# Altium project SOM Board with RK3399.PrjPcb (part 2 of 4)

## Sheet [7]-RGMII_SDIO_SPI_GPIOs etc.SchDoc: RK3399 SOM Board Design V1.0
size A3; Author: ABC; Organization: Altium Limited; Address1: L3, 12a Rodborough Rd; Address2: Frenchs Forest; Address3: NSW; Address4: Australia 2086; DocumentNumber: 9; SheetNumber: 9; SheetTotal: 21; PROJECT CODE: A_V1.0
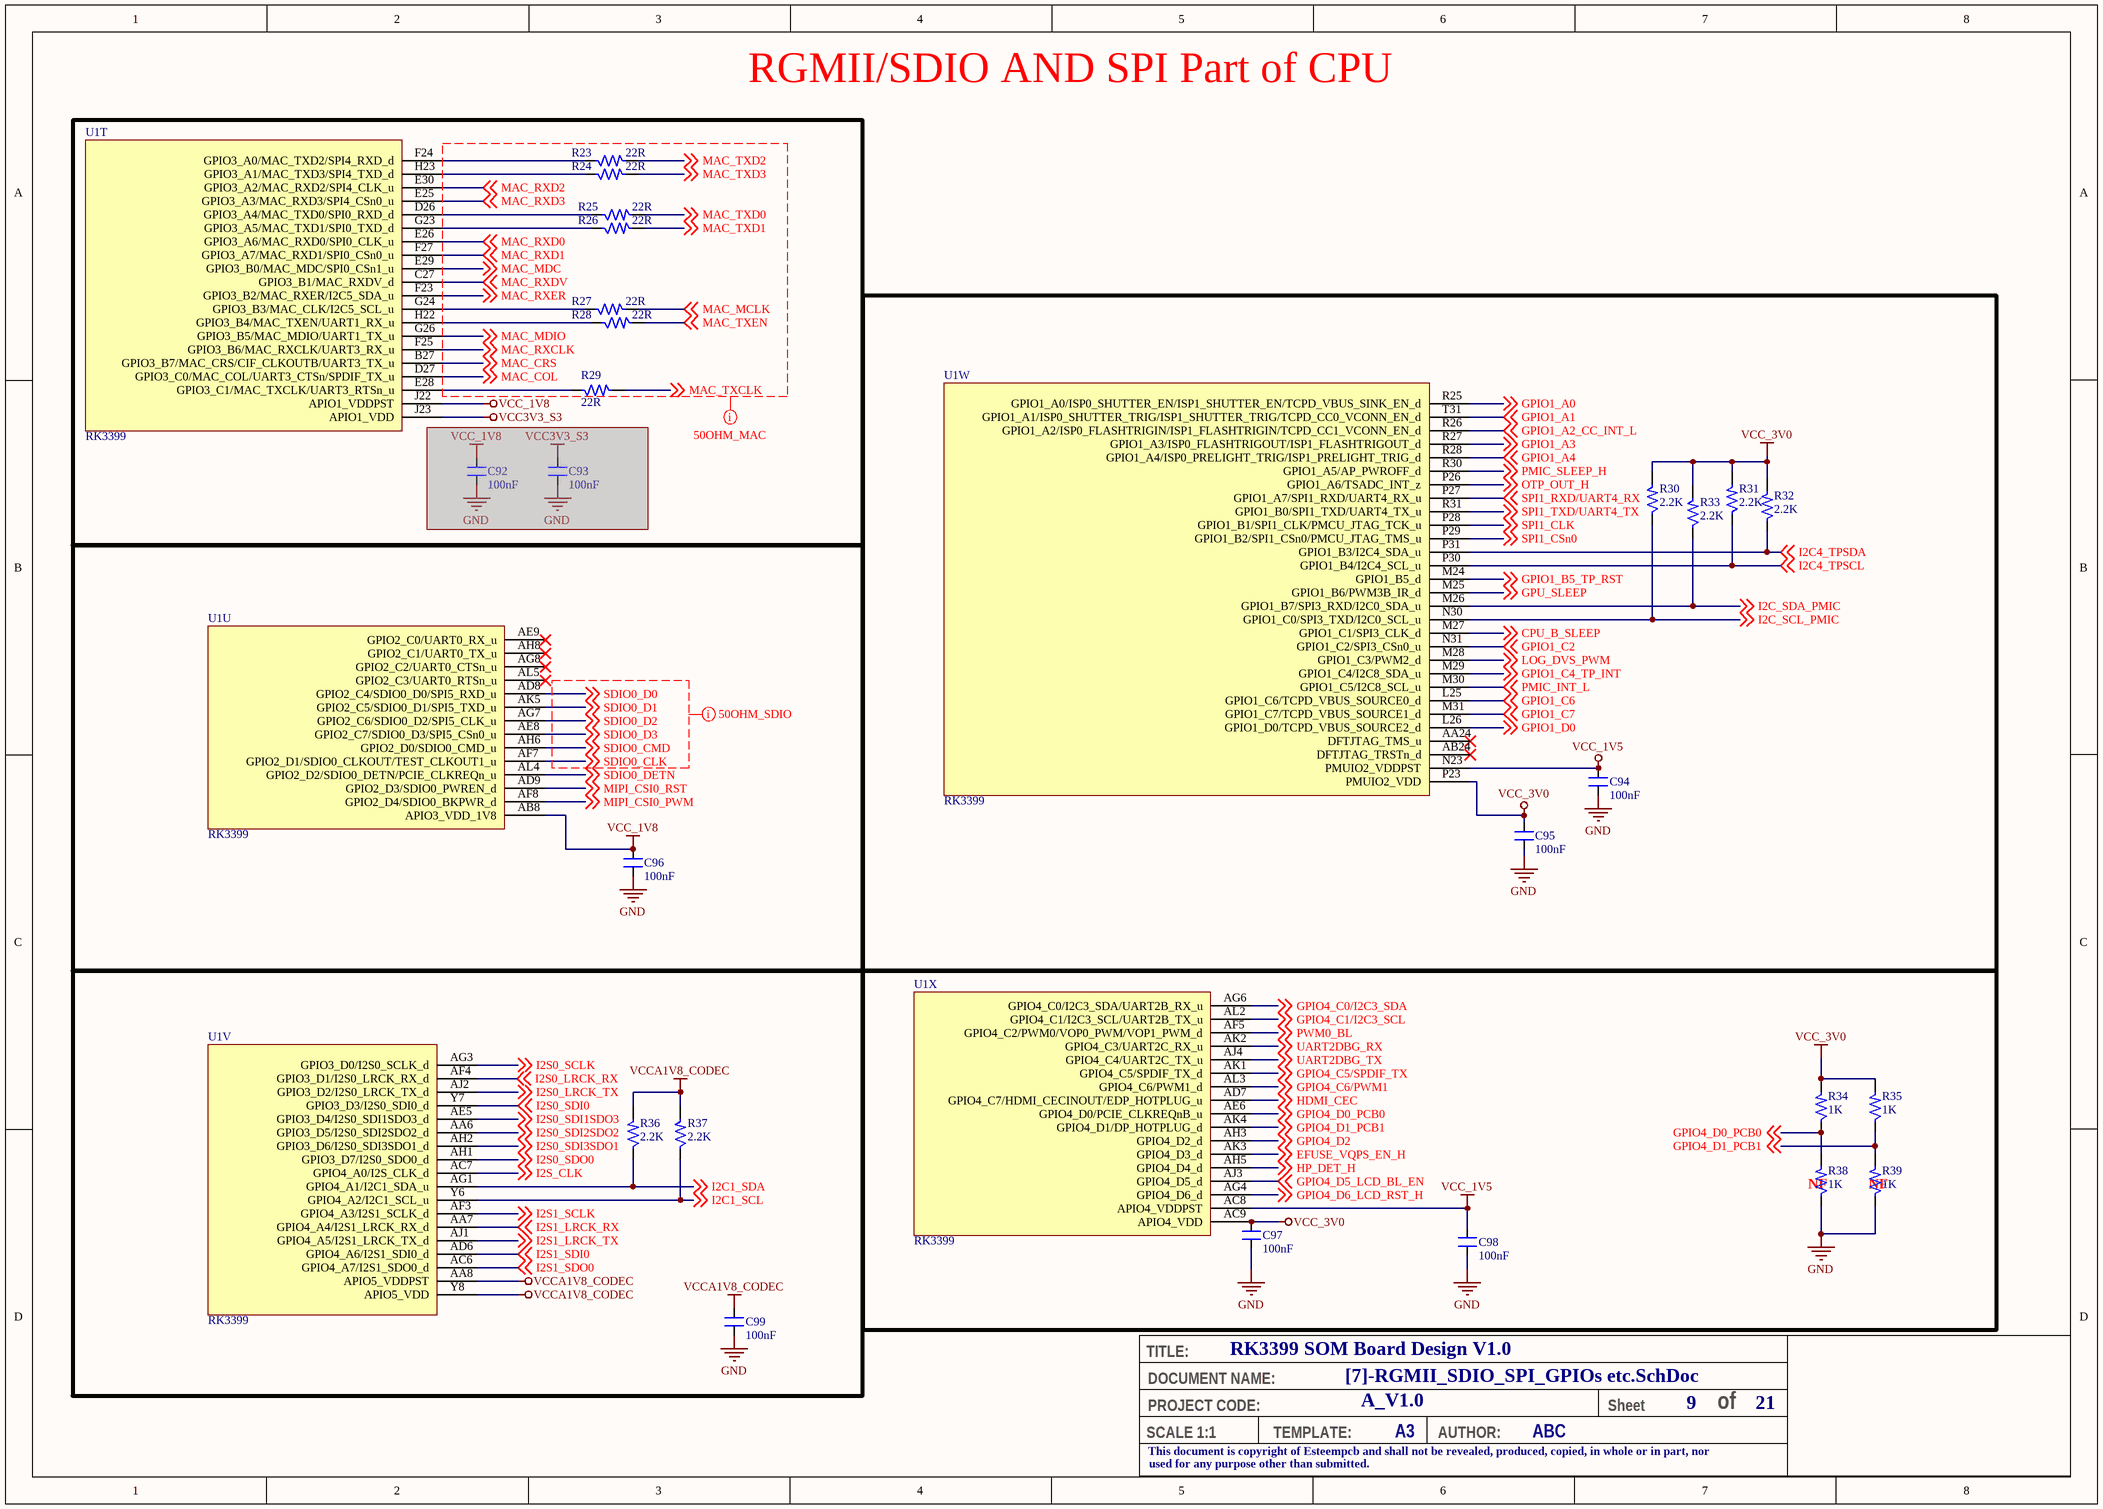
[diagram p8: [7]-RGMII_SDIO_SPI_GPIOs etc.SchDoc]

### Parts
(Parts that share a designator on the sheet are numbered #1, #2 ... from top to bottom, then left to right.)
C92#1  100nF  [CAP_0201]  (masked out: inside a compile mask, not in the netlist)
C93#1  100nF  [CAP_0201]  (masked out: inside a compile mask, not in the netlist)
C94  100nF  [CAP_0201]
C95  100nF  [CAP_0201]
C96  100nF  [CAP_0201]
C97  100nF  [CAP_0201]
C98  100nF  [CAP_0201]
C99  100nF  [CAP_0201]
R23  22R  [RES_0201]
R24  22R  [RES_0201]
R25  22R  [RES_0201]
R26  22R  [RES_0201]
R27  22R  [RES_0201]
R28  22R  [RES_0201]
R29  22R  [RES_0201]
R30  2.2K  [RES_0201]
R31  2.2K  [RES_0201]
R32  2.2K  [RES_0201]
R33  2.2K  [RES_0201]
R34  1K  [RES_0201]
R35  1K  [RES_0201]
R36  2.2K  [RES_0201]
R37  2.2K  [RES_0201]
R38  1K  [RES_0201]
R39  1K  [RES_0201]
U1  RK3399  [FBGA828_23_826X826]  (parts T,U,V,W,X of 24)

### Nets
GND: C94.1 C95.1 C96.1 C97.1 C98.1 C99.1 R38.1 R39.1
VCC3V3_S3: U1.J23(APIO1_VDD)
VCC_1V5: C94.2 C98.2 U1.AC8(APIO4_VDDPST) U1.N23(PMUIO2_VDDPST)
VCC_1V8: C96.2 U1.AB8(APIO3_VDD_1V8) U1.J22(APIO1_VDDPST)
VCC_3V0: C95.2 C97.2 R30.2 R31.2 R32.2 R33.2 R34.2 R35.2 U1.AC9(APIO4_VDD) U1.P23(PMUIO2_VDD)
VCCA1V8_CODEC: C99.2 R36.2 R37.2 U1.AA8(APIO5_VDDPST) U1.Y8(APIO5_VDD)
CPU_B_SLEEP: U1.M27(GPIO1_C1/SPI3_CLK_d) ; off-sheet CPU_B_SLEEP
EFUSE_VQPS_EN_H: U1.AK3(GPIO4_D3_d) ; off-sheet EFUSE_VQPS_EN_H
GPIO1_A0: U1.R25(GPIO1_A0/ISP0_SHUTTER_EN/ISP1_SHUTTER_EN/TCPD_VBUS_SINK_EN_d) ; off-sheet GPIO1_A0
GPIO1_A1: U1.T31(GPIO1_A1/ISP0_SHUTTER_TRIG/ISP1_SHUTTER_TRIG/TCPD_CC0_VCONN_EN_d) ; off-sheet GPIO1_A1
GPIO1_A2_CC_INT_L: U1.R26(GPIO1_A2/ISP0_FLASHTRIGIN/ISP1_FLASHTRIGIN/TCPD_CC1_VCONN_EN_d) ; off-sheet GPIO1_A2_CC_INT_L
GPIO1_A3: U1.R27(GPIO1_A3/ISP0_FLASHTRIGOUT/ISP1_FLASHTRIGOUT_d) ; off-sheet GPIO1_A3
GPIO1_A4: U1.R28(GPIO1_A4/ISP0_PRELIGHT_TRIG/ISP1_PRELIGHT_TRIG_d) ; off-sheet GPIO1_A4
GPIO1_B5_TP_RST: U1.M24(GPIO1_B5_d) ; off-sheet GPIO1_B5_TP_RST
GPIO1_C2: U1.N31(GPIO1_C2/SPI3_CSn0_u) ; off-sheet GPIO1_C2
GPIO1_C4_TP_INT: U1.M29(GPIO1_C4/I2C8_SDA_u) ; off-sheet GPIO1_C4_TP_INT
GPIO1_C6: U1.L25(GPIO1_C6/TCPD_VBUS_SOURCE0_d) ; off-sheet GPIO1_C6
GPIO1_C7: U1.M31(GPIO1_C7/TCPD_VBUS_SOURCE1_d) ; off-sheet GPIO1_C7
GPIO1_D0: U1.L26(GPIO1_D0/TCPD_VBUS_SOURCE2_d) ; off-sheet GPIO1_D0
GPIO4_C0/I2C3_SDA: U1.AG6(GPIO4_C0/I2C3_SDA/UART2B_RX_u) ; off-sheet GPIO4_C0/I2C3_SDA
GPIO4_C1/I2C3_SCL: U1.AL2(GPIO4_C1/I2C3_SCL/UART2B_TX_u) ; off-sheet GPIO4_C1/I2C3_SCL
GPIO4_C5/SPDIF_TX: U1.AK1(GPIO4_C5/SPDIF_TX_d) ; off-sheet GPIO4_C5/SPDIF_TX
GPIO4_C6/PWM1: U1.AL3(GPIO4_C6/PWM1_d) ; off-sheet GPIO4_C6/PWM1
GPIO4_D0_PCB0: R34.1 R38.2 U1.AE6(GPIO4_D0/PCIE_CLKREQnB_u) ; off-sheet GPIO4_D0_PCB0
GPIO4_D1_PCB1: R35.1 R39.2 U1.AK4(GPIO4_D1/DP_HOTPLUG_d) ; off-sheet GPIO4_D1_PCB1
GPIO4_D2: U1.AH3(GPIO4_D2_d) ; off-sheet GPIO4_D2
GPIO4_D5_LCD_BL_EN: U1.AJ3(GPIO4_D5_d) ; off-sheet GPIO4_D5_LCD_BL_EN
GPIO4_D6_LCD_RST_H: U1.AG4(GPIO4_D6_d) ; off-sheet GPIO4_D6_LCD_RST_H
GPU_SLEEP: U1.M25(GPIO1_B6/PWM3B_IR_d) ; off-sheet GPU_SLEEP
HDMI_CEC: U1.AD7(GPIO4_C7/HDMI_CECINOUT/EDP_HOTPLUG_u) ; off-sheet HDMI_CEC
HP_DET_H: U1.AH5(GPIO4_D4_d) ; off-sheet HP_DET_H
I2C1_SCL: R37.1 U1.Y6(GPIO4_A2/I2C1_SCL_u) ; off-sheet I2C1_SCL
I2C1_SDA: R36.1 U1.AG1(GPIO4_A1/I2C1_SDA_u) ; off-sheet I2C1_SDA
I2C4_TPSCL: R31.1 U1.P30(GPIO1_B4/I2C4_SCL_u) ; off-sheet I2C4_TPSCL
I2C4_TPSDA: R32.1 U1.P31(GPIO1_B3/I2C4_SDA_u) ; off-sheet I2C4_TPSDA
I2C_SCL_PMIC: R30.1 U1.N30(GPIO1_C0/SPI3_TXD/I2C0_SCL_u) ; off-sheet I2C_SCL_PMIC
I2C_SDA_PMIC: R33.1 U1.M26(GPIO1_B7/SPI3_RXD/I2C0_SDA_u) ; off-sheet I2C_SDA_PMIC
I2S0_LRCK_RX: U1.AF4(GPIO3_D1/I2S0_LRCK_RX_d) ; off-sheet I2S0_LRCK_RX
I2S0_LRCK_TX: U1.AJ2(GPIO3_D2/I2S0_LRCK_TX_d) ; off-sheet I2S0_LRCK_TX
I2S0_SCLK: U1.AG3(GPIO3_D0/I2S0_SCLK_d) ; off-sheet I2S0_SCLK
I2S0_SDI0: U1.Y7(GPIO3_D3/I2S0_SDI0_d) ; off-sheet I2S0_SDI0
I2S0_SDI1SDO3: U1.AE5(GPIO3_D4/I2S0_SDI1SDO3_d) ; off-sheet I2S0_SDI1SDO3
I2S0_SDI2SDO2: U1.AA6(GPIO3_D5/I2S0_SDI2SDO2_d) ; off-sheet I2S0_SDI2SDO2
I2S0_SDI3SDO1: U1.AH2(GPIO3_D6/I2S0_SDI3SDO1_d) ; off-sheet I2S0_SDI3SDO1
I2S0_SDO0: U1.AH1(GPIO3_D7/I2S0_SDO0_d) ; off-sheet I2S0_SDO0
I2S1_LRCK_RX: U1.AA7(GPIO4_A4/I2S1_LRCK_RX_d) ; off-sheet I2S1_LRCK_RX
I2S1_LRCK_TX: U1.AJ1(GPIO4_A5/I2S1_LRCK_TX_d) ; off-sheet I2S1_LRCK_TX
I2S1_SCLK: U1.AF3(GPIO4_A3/I2S1_SCLK_d) ; off-sheet I2S1_SCLK
I2S1_SDI0: U1.AD6(GPIO4_A6/I2S1_SDI0_d) ; off-sheet I2S1_SDI0
I2S1_SDO0: U1.AC6(GPIO4_A7/I2S1_SDO0_d) ; off-sheet I2S1_SDO0
I2S_CLK: U1.AC7(GPIO4_A0/I2S_CLK_d) ; off-sheet I2S_CLK
LOG_DVS_PWM: U1.M28(GPIO1_C3/PWM2_d) ; off-sheet LOG_DVS_PWM
MAC_COL: U1.D27(GPIO3_C0/MAC_COL/UART3_CTSn/SPDIF_TX_u) ; off-sheet MAC_COL
MAC_CRS: U1.B27(GPIO3_B7/MAC_CRS/CIF_CLKOUTB/UART3_TX_u) ; off-sheet MAC_CRS
MAC_MCLK: R27.2 ; off-sheet MAC_MCLK
MAC_MDC: U1.E29(GPIO3_B0/MAC_MDC/SPI0_CSn1_u) ; off-sheet MAC_MDC
MAC_MDIO: U1.G26(GPIO3_B5/MAC_MDIO/UART1_TX_u) ; off-sheet MAC_MDIO
MAC_RXCLK: U1.F25(GPIO3_B6/MAC_RXCLK/UART3_RX_u) ; off-sheet MAC_RXCLK
MAC_RXD0: U1.E26(GPIO3_A6/MAC_RXD0/SPI0_CLK_u) ; off-sheet MAC_RXD0
MAC_RXD1: U1.F27(GPIO3_A7/MAC_RXD1/SPI0_CSn0_u) ; off-sheet MAC_RXD1
MAC_RXD2: U1.E30(GPIO3_A2/MAC_RXD2/SPI4_CLK_u) ; off-sheet MAC_RXD2
MAC_RXD3: U1.E25(GPIO3_A3/MAC_RXD3/SPI4_CSn0_u) ; off-sheet MAC_RXD3
MAC_RXDV: U1.C27(GPIO3_B1/MAC_RXDV_d) ; off-sheet MAC_RXDV
MAC_RXER: U1.F23(GPIO3_B2/MAC_RXER/I2C5_SDA_u) ; off-sheet MAC_RXER
MAC_TXCLK: R29.2 ; off-sheet MAC_TXCLK
MAC_TXD0: R25.2 ; off-sheet MAC_TXD0
MAC_TXD1: R26.2 ; off-sheet MAC_TXD1
MAC_TXD2: R23.2 ; off-sheet MAC_TXD2
MAC_TXD3: R24.2 ; off-sheet MAC_TXD3
MAC_TXEN: R28.2 ; off-sheet MAC_TXEN
MIPI_CSI0_PWM: U1.AF8(GPIO2_D4/SDIO0_BKPWR_d) ; off-sheet MIPI_CSI0_PWM
MIPI_CSI0_RST: U1.AD9(GPIO2_D3/SDIO0_PWREN_d) ; off-sheet MIPI_CSI0_RST
OTP_OUT_H: U1.P26(GPIO1_A6/TSADC_INT_z) ; off-sheet OTP_OUT_H
PMIC_INT_L: U1.M30(GPIO1_C5/I2C8_SCL_u) ; off-sheet PMIC_INT_L
PMIC_SLEEP_H: U1.R30(GPIO1_A5/AP_PWROFF_d) ; off-sheet PMIC_SLEEP_H
PWM0_BL: U1.AF5(GPIO4_C2/PWM0/VOP0_PWM/VOP1_PWM_d) ; off-sheet PWM0_BL
SDIO0_CLK: U1.AF7(GPIO2_D1/SDIO0_CLKOUT/TEST_CLKOUT1_u) ; off-sheet SDIO0_CLK
SDIO0_CMD: U1.AH6(GPIO2_D0/SDIO0_CMD_u) ; off-sheet SDIO0_CMD
SDIO0_D0: U1.AD8(GPIO2_C4/SDIO0_D0/SPI5_RXD_u) ; off-sheet SDIO0_D0
SDIO0_D1: U1.AK5(GPIO2_C5/SDIO0_D1/SPI5_TXD_u) ; off-sheet SDIO0_D1
SDIO0_D2: U1.AG7(GPIO2_C6/SDIO0_D2/SPI5_CLK_u) ; off-sheet SDIO0_D2
SDIO0_D3: U1.AE8(GPIO2_C7/SDIO0_D3/SPI5_CSn0_u) ; off-sheet SDIO0_D3
SDIO0_DETN: U1.AL4(GPIO2_D2/SDIO0_DETN/PCIE_CLKREQn_u) ; off-sheet SDIO0_DETN
SPI1_CLK: U1.P28(GPIO1_B1/SPI1_CLK/PMCU_JTAG_TCK_u) ; off-sheet SPI1_CLK
SPI1_CSn0: U1.P29(GPIO1_B2/SPI1_CSn0/PMCU_JTAG_TMS_u) ; off-sheet SPI1_CSn0
SPI1_RXD/UART4_RX: U1.P27(GPIO1_A7/SPI1_RXD/UART4_RX_u) ; off-sheet SPI1_RXD/UART4_RX
SPI1_TXD/UART4_TX: U1.R31(GPIO1_B0/SPI1_TXD/UART4_TX_u) ; off-sheet SPI1_TXD/UART4_TX
UART2DBG_RX: U1.AK2(GPIO4_C3/UART2C_RX_u) ; off-sheet UART2DBG_RX
UART2DBG_TX: U1.AJ4(GPIO4_C4/UART2C_TX_u) ; off-sheet UART2DBG_TX
NetR23_1: R23.1 U1.F24(GPIO3_A0/MAC_TXD2/SPI4_RXD_d)
NetR24_1: R24.1 U1.H23(GPIO3_A1/MAC_TXD3/SPI4_TXD_d)
NetR25_1: R25.1 U1.D26(GPIO3_A4/MAC_TXD0/SPI0_RXD_d)
NetR26_1: R26.1 U1.G23(GPIO3_A5/MAC_TXD1/SPI0_TXD_d)
NetR27_1: R27.1 U1.G24(GPIO3_B3/MAC_CLK/I2C5_SCL_u)
NetR28_1: R28.1 U1.H22(GPIO3_B4/MAC_TXEN/UART1_RX_u)
NetR29_1: R29.1 U1.E28(GPIO3_C1/MAC_TXCLK/UART3_RTSn_u)

Not connected (* = marked no-connect by the designer): U1 AA24(DFTJTAG_TMS_u)* AB24(DFTJTAG_TRSTn_d)* AE9(GPIO2_C0/UART0_RX_u)* AG8(GPIO2_C2/UART0_CTSn_u)* AH8(GPIO2_C1/UART0_TX_u)* AL5(GPIO2_C3/UART0_RTSn_u)*

### Layout directives
net class 50OHM_MAC: MAC_COL, MAC_CRS, MAC_MCLK, MAC_MDC, MAC_MDIO, MAC_RXCLK, MAC_RXD0, MAC_RXD1, MAC_RXD2, MAC_RXD3, MAC_RXDV, MAC_RXER, MAC_TXCLK, MAC_TXD0, MAC_TXD1, MAC_TXD2, MAC_TXD3, MAC_TXEN
net class 50OHM_SDIO: SDIO0_CLK, SDIO0_CMD, SDIO0_D0, SDIO0_D1, SDIO0_D2, SDIO0_D3

### Notes on the sheet
- RGMII/SDIO AND SPI Part of CPU
- (near R38) NF
- (near R39) NF
- TITLE:
- DOCUMENT NAME:
- SCALE 1:1
- This document is copyright of Esteempcb and shall not be revealed, produced, copied, in whole or in part, nor
- PROJECT CODE:
- TEMPLATE:
- A3
- AUTHOR:
- Sheet
- of
- used for any purpose other than submitted.

### Library data of the parts
C92#1 C93#1 C94-C99 = CAP_100nF-25V-10%-0201: as C9 on sheet [1]-Power Pins Page of RK3399; Case/Package: 0201; Supplier-1: Digikey
R23-R29 = RES_22R-0.05W-1%-0201: 22 Ohms ±1% 0.05W, 1/20W Chip Resistor 0201 (0603 Metric) Moisture Resistant Thick Film /; Manufacturer: Yageo; Manufacturer Part Number: RC0201FR-0722RL; Case/Package: 0201; Supplier-1: Digikey
R30-R33 R36 R37 = RES_2.2K-0.05W-1%-0201: 2.2 kOhms ±1% 0.05W, 1/20W Chip Resistor 0201 (0603 Metric) Thick Film /; Manufacturer: Stackpole Electronics Inc; Manufacturer Part Number: RMCF0201FT2K20; Case/Package: 0201; Supplier-1: Digikey
R34 R35 R38 R39 = RES_1K-0.05W-1%-0201: 1 kOhms ±1% 0.05W, 1/20W Chip Resistor 0201 (0603 Metric) Thick Film /; Manufacturer: Yageo; Manufacturer Part Number: RC0201FR-071KL; Case/Package: 0201; Supplier-1: Digikey
U1 = IC_RK3399-FCBGA828: as U1 on sheet [1]-Power Pins Page of RK3399; Manufacturer Part Number: RK3399; Case/Package: FCBGA828; Supplier-1: Rockchip

## Sheet [8]-RK3399 SDRAM Page.SchDoc: RK3399 SOM Board Design V1.0
size A3; Author: ABC; Organization: Altium Limited; Address1: L3, 12a Rodborough Rd; Address2: Frenchs Forest; Address3: NSW; Address4: Australia 2086; DocumentNumber: 10; SheetNumber: 10; SheetTotal: 21; PROJECT CODE: A_V1.0
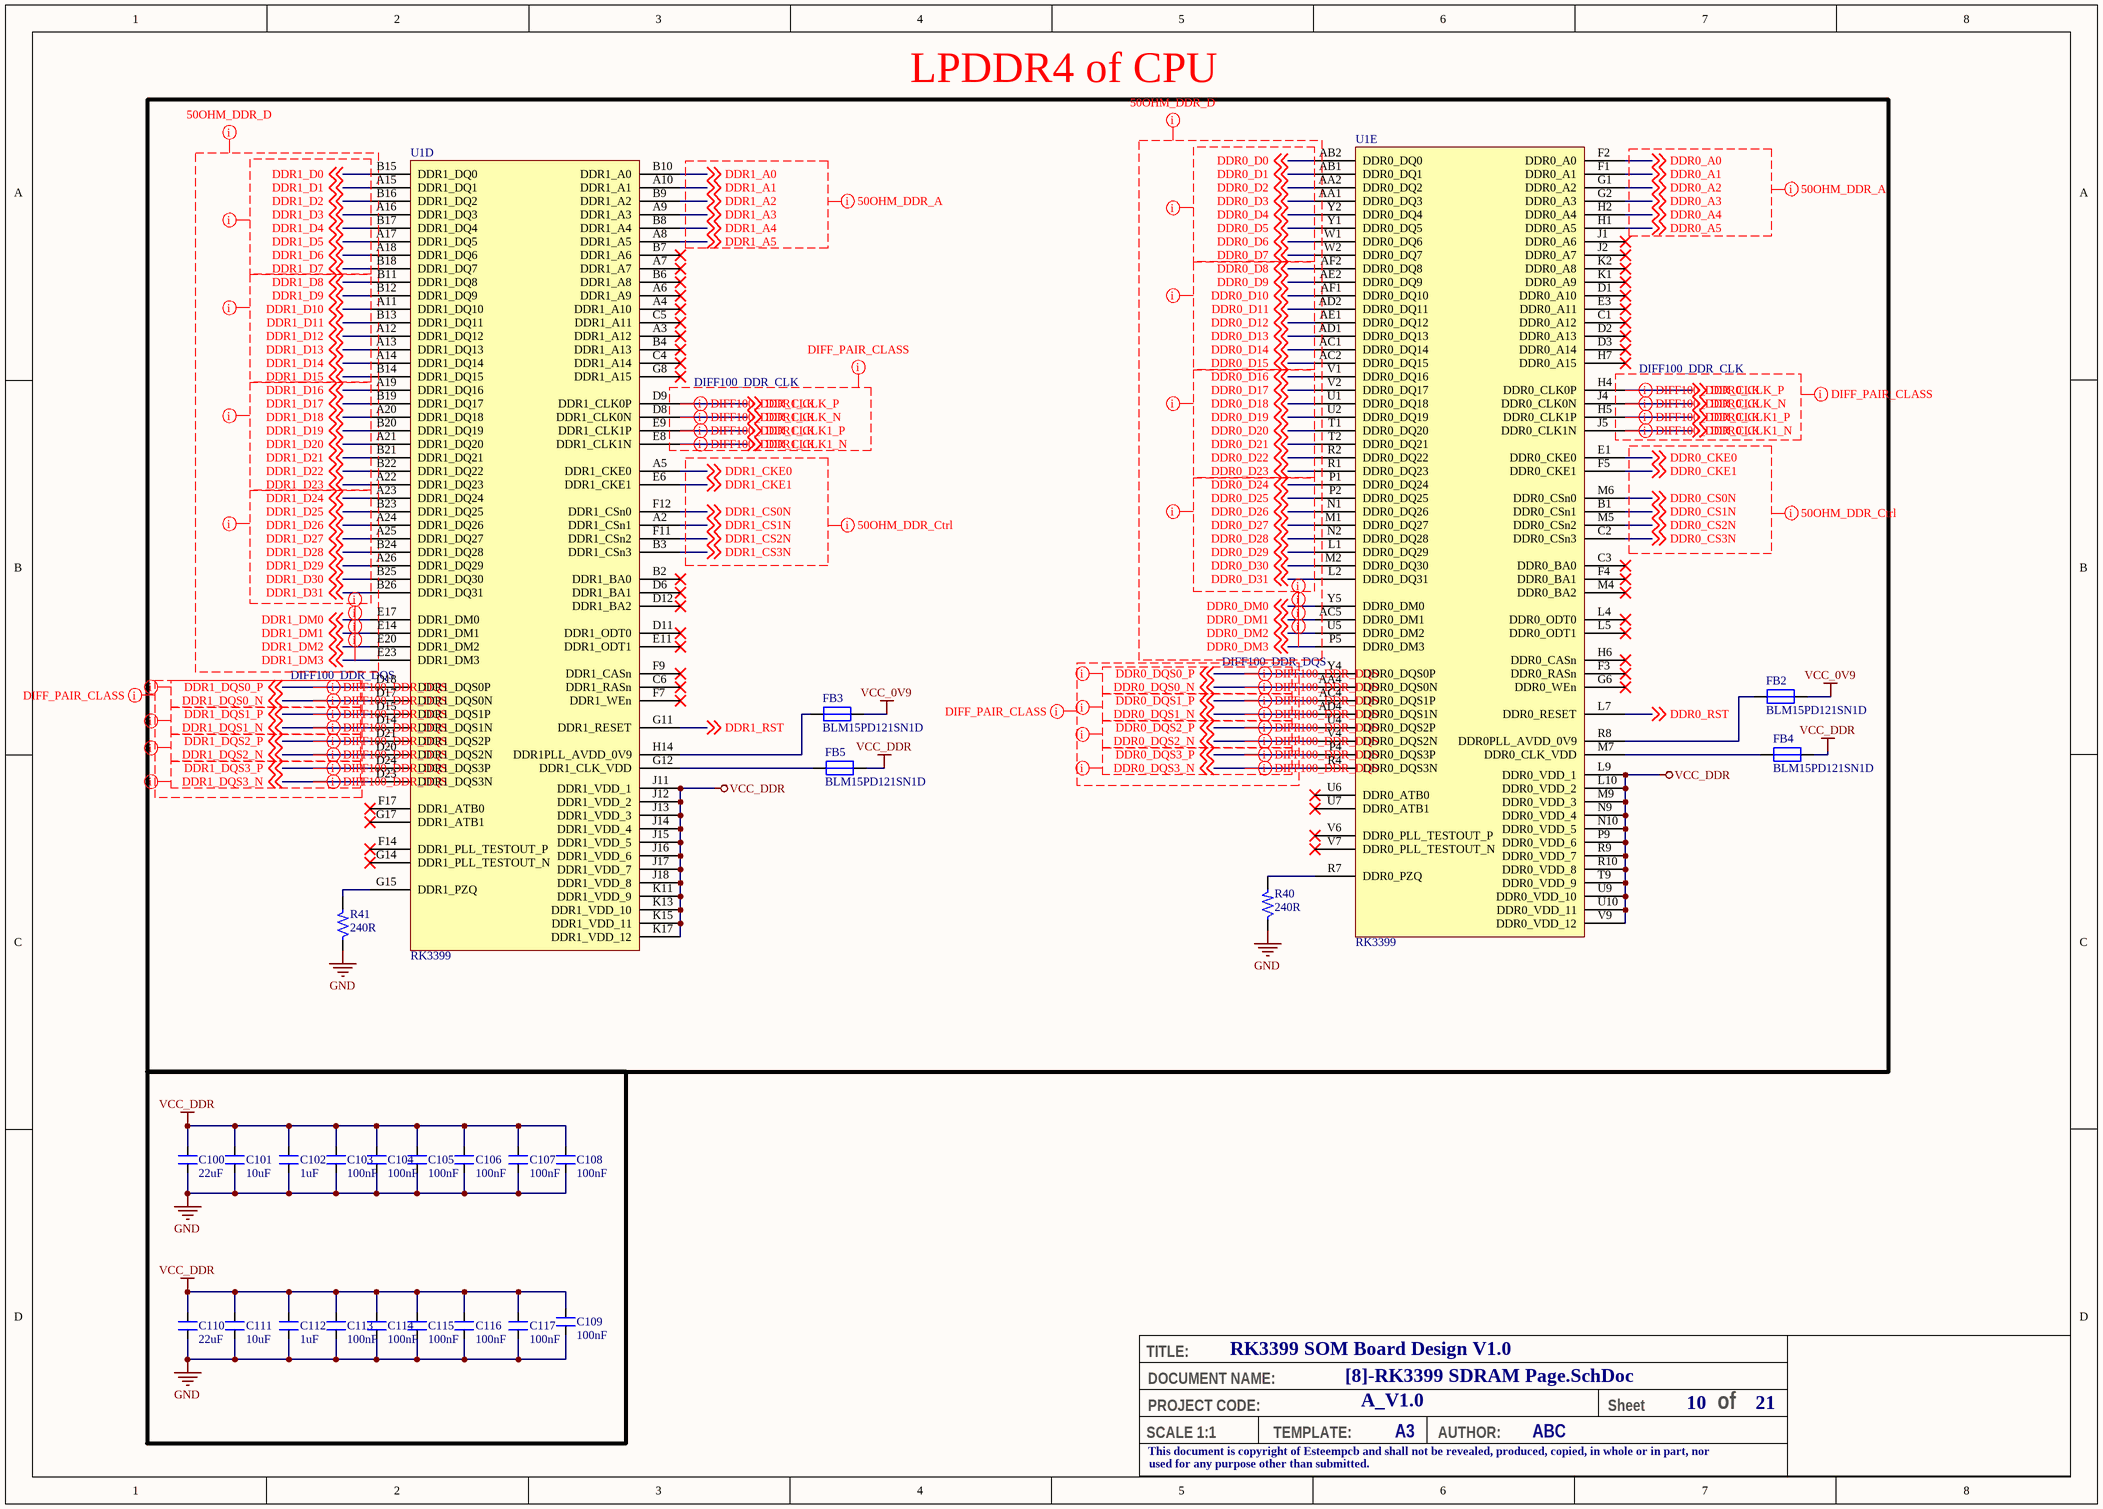
[diagram p9: [8]-RK3399 SDRAM Page.SchDoc]

### Parts
C100  22uF  [CAP_0402]
C101  10uF  [CAP_0402]
C102  1uF  [CAP_0201]
C103  100nF  [CAP_0201]
C104  100nF  [CAP_0201]
C105  100nF  [CAP_0201]
C106  100nF  [CAP_0201]
C107  100nF  [CAP_0201]
C108  100nF  [CAP_0201]
C109  100nF  [CAP_0201]
C110  22uF  [CAP_0402]
C111  10uF  [CAP_0402]
C112  1uF  [CAP_0201]
C113  100nF  [CAP_0201]
C114  100nF  [CAP_0201]
C115  100nF  [CAP_0201]
C116  100nF  [CAP_0201]
C117  100nF  [CAP_0201]
FB2  BLM15PD121SN1D  [RES_0402]
FB3  BLM15PD121SN1D  [RES_0402]
FB4  BLM15PD121SN1D  [RES_0402]
FB5  BLM15PD121SN1D  [RES_0402]
R40  240R  [RES_0201]
R41  240R  [RES_0201]
U1  RK3399  [FBGA828_23_826X826]  (parts D,E of 24)

### Blocks framed on the sheet
LPDDR4 of CPU: FB2-FB5 R40 R41 U1

### Nets
GND: C100.1 C101.1 C102.1 C103.1 C104.1 C105.1 C106.1 C107.1 C108.1 C109.1 C110.1 C111.1 C112.1 C113.1 C114.1 C115.1 C116.1 C117.1 R40.1 R41.1
VCC_0V9: FB2.2 FB3.2
VCC_DDR: C100.2 C101.2 C102.2 C103.2 C104.2 C105.2 C106.2 C107.2 C108.2 C109.2 C110.2 C111.2 C112.2 C113.2 C114.2 C115.2 C116.2 C117.2 FB4.2 FB5.2 U1.J11(DDR1_VDD_1) U1.J12(DDR1_VDD_2) U1.J13(DDR1_VDD_3) U1.J14(DDR1_VDD_4) U1.J15(DDR1_VDD_5) U1.J16(DDR1_VDD_6) U1.J17(DDR1_VDD_7) U1.J18(DDR1_VDD_8) U1.K11(DDR1_VDD_9) U1.K13(DDR1_VDD_10) U1.K15(DDR1_VDD_11) U1.K17(DDR1_VDD_12) U1.L9(DDR0_VDD_1) U1.L10(DDR0_VDD_2) U1.M9(DDR0_VDD_3) U1.N9(DDR0_VDD_4) U1.N10(DDR0_VDD_5) U1.P9(DDR0_VDD_6) U1.R9(DDR0_VDD_7) U1.R10(DDR0_VDD_8) U1.T9(DDR0_VDD_9) U1.U9(DDR0_VDD_10) U1.U10(DDR0_VDD_11) U1.V9(DDR0_VDD_12)
DDR0_A0: U1.F2(DDR0_A0) ; off-sheet DDR0_A0
DDR0_A1: U1.F1(DDR0_A1) ; off-sheet DDR0_A1
DDR0_A2: U1.G1(DDR0_A2) ; off-sheet DDR0_A2
DDR0_A3: U1.G2(DDR0_A3) ; off-sheet DDR0_A3
DDR0_A4: U1.H2(DDR0_A4) ; off-sheet DDR0_A4
DDR0_A5: U1.H1(DDR0_A5) ; off-sheet DDR0_A5
DDR0_CKE0: U1.E1(DDR0_CKE0) ; off-sheet DDR0_CKE0
DDR0_CKE1: U1.F5(DDR0_CKE1) ; off-sheet DDR0_CKE1
DDR0_CLK1_N: U1.J5(DDR0_CLK1N) ; off-sheet DDR0_CLK1_N
DDR0_CLK1_P: U1.H5(DDR0_CLK1P) ; off-sheet DDR0_CLK1_P
DDR0_CLK_N: U1.J4(DDR0_CLK0N) ; off-sheet DDR0_CLK_N
DDR0_CLK_P: U1.H4(DDR0_CLK0P) ; off-sheet DDR0_CLK_P
DDR0_CS0N: U1.M6(DDR0_CSn0) ; off-sheet DDR0_CS0N
DDR0_CS1N: U1.B1(DDR0_CSn1) ; off-sheet DDR0_CS1N
DDR0_CS2N: U1.M5(DDR0_CSn2) ; off-sheet DDR0_CS2N
DDR0_CS3N: U1.C2(DDR0_CSn3) ; off-sheet DDR0_CS3N
DDR0_D0: U1.AB2(DDR0_DQ0) ; off-sheet DDR0_D0
DDR0_D1: U1.AB1(DDR0_DQ1) ; off-sheet DDR0_D1
DDR0_D2: U1.AA2(DDR0_DQ2) ; off-sheet DDR0_D2
DDR0_D3: U1.AA1(DDR0_DQ3) ; off-sheet DDR0_D3
DDR0_D4: U1.Y2(DDR0_DQ4) ; off-sheet DDR0_D4
DDR0_D5: U1.Y1(DDR0_DQ5) ; off-sheet DDR0_D5
DDR0_D6: U1.W1(DDR0_DQ6) ; off-sheet DDR0_D6
DDR0_D7: U1.W2(DDR0_DQ7) ; off-sheet DDR0_D7
DDR0_D8: U1.AF2(DDR0_DQ8) ; off-sheet DDR0_D8
DDR0_D9: U1.AE2(DDR0_DQ9) ; off-sheet DDR0_D9
DDR0_D10: U1.AF1(DDR0_DQ10) ; off-sheet DDR0_D10
DDR0_D11: U1.AD2(DDR0_DQ11) ; off-sheet DDR0_D11
DDR0_D12: U1.AE1(DDR0_DQ12) ; off-sheet DDR0_D12
DDR0_D13: U1.AD1(DDR0_DQ13) ; off-sheet DDR0_D13
DDR0_D14: U1.AC1(DDR0_DQ14) ; off-sheet DDR0_D14
DDR0_D15: U1.AC2(DDR0_DQ15) ; off-sheet DDR0_D15
DDR0_D16: U1.V1(DDR0_DQ16) ; off-sheet DDR0_D16
DDR0_D17: U1.V2(DDR0_DQ17) ; off-sheet DDR0_D17
DDR0_D18: U1.U1(DDR0_DQ18) ; off-sheet DDR0_D18
DDR0_D19: U1.U2(DDR0_DQ19) ; off-sheet DDR0_D19
DDR0_D20: U1.T1(DDR0_DQ20) ; off-sheet DDR0_D20
DDR0_D21: U1.T2(DDR0_DQ21) ; off-sheet DDR0_D21
DDR0_D22: U1.R2(DDR0_DQ22) ; off-sheet DDR0_D22
DDR0_D23: U1.R1(DDR0_DQ23) ; off-sheet DDR0_D23
DDR0_D24: U1.P1(DDR0_DQ24) ; off-sheet DDR0_D24
DDR0_D25: U1.P2(DDR0_DQ25) ; off-sheet DDR0_D25
DDR0_D26: U1.N1(DDR0_DQ26) ; off-sheet DDR0_D26
DDR0_D27: U1.M1(DDR0_DQ27) ; off-sheet DDR0_D27
DDR0_D28: U1.N2(DDR0_DQ28) ; off-sheet DDR0_D28
DDR0_D29: U1.L1(DDR0_DQ29) ; off-sheet DDR0_D29
DDR0_D30: U1.M2(DDR0_DQ30) ; off-sheet DDR0_D30
DDR0_D31: U1.L2(DDR0_DQ31) ; off-sheet DDR0_D31
DDR0_DM0: U1.Y5(DDR0_DM0) ; off-sheet DDR0_DM0
DDR0_DM1: U1.AC5(DDR0_DM1) ; off-sheet DDR0_DM1
DDR0_DM2: U1.U5(DDR0_DM2) ; off-sheet DDR0_DM2
DDR0_DM3: U1.P5(DDR0_DM3) ; off-sheet DDR0_DM3
DDR0_DQS0_N: U1.AA4(DDR0_DQS0N) ; off-sheet DDR0_DQS0_N
DDR0_DQS0_P: U1.Y4(DDR0_DQS0P) ; off-sheet DDR0_DQS0_P
DDR0_DQS1_N: U1.AD4(DDR0_DQS1N) ; off-sheet DDR0_DQS1_N
DDR0_DQS1_P: U1.AC4(DDR0_DQS1P) ; off-sheet DDR0_DQS1_P
DDR0_DQS2_N: U1.V4(DDR0_DQS2N) ; off-sheet DDR0_DQS2_N
DDR0_DQS2_P: U1.U4(DDR0_DQS2P) ; off-sheet DDR0_DQS2_P
DDR0_DQS3_N: U1.R4(DDR0_DQS3N) ; off-sheet DDR0_DQS3_N
DDR0_DQS3_P: U1.P4(DDR0_DQS3P) ; off-sheet DDR0_DQS3_P
DDR0_RST: U1.L7(DDR0_RESET) ; off-sheet DDR0_RST
DDR1_A0: U1.B10(DDR1_A0) ; off-sheet DDR1_A0
DDR1_A1: U1.A10(DDR1_A1) ; off-sheet DDR1_A1
DDR1_A2: U1.B9(DDR1_A2) ; off-sheet DDR1_A2
DDR1_A3: U1.A9(DDR1_A3) ; off-sheet DDR1_A3
DDR1_A4: U1.B8(DDR1_A4) ; off-sheet DDR1_A4
DDR1_A5: U1.A8(DDR1_A5) ; off-sheet DDR1_A5
DDR1_CKE0: U1.A5(DDR1_CKE0) ; off-sheet DDR1_CKE0
DDR1_CKE1: U1.E6(DDR1_CKE1) ; off-sheet DDR1_CKE1
DDR1_CLK1_N: U1.E8(DDR1_CLK1N) ; off-sheet DDR1_CLK1_N
DDR1_CLK1_P: U1.E9(DDR1_CLK1P) ; off-sheet DDR1_CLK1_P
DDR1_CLK_N: U1.D8(DDR1_CLK0N) ; off-sheet DDR1_CLK_N
DDR1_CLK_P: U1.D9(DDR1_CLK0P) ; off-sheet DDR1_CLK_P
DDR1_CS0N: U1.F12(DDR1_CSn0) ; off-sheet DDR1_CS0N
DDR1_CS1N: U1.A2(DDR1_CSn1) ; off-sheet DDR1_CS1N
DDR1_CS2N: U1.F11(DDR1_CSn2) ; off-sheet DDR1_CS2N
DDR1_CS3N: U1.B3(DDR1_CSn3) ; off-sheet DDR1_CS3N
DDR1_D0: U1.B15(DDR1_DQ0) ; off-sheet DDR1_D0
DDR1_D1: U1.A15(DDR1_DQ1) ; off-sheet DDR1_D1
DDR1_D2: U1.B16(DDR1_DQ2) ; off-sheet DDR1_D2
DDR1_D3: U1.A16(DDR1_DQ3) ; off-sheet DDR1_D3
DDR1_D4: U1.B17(DDR1_DQ4) ; off-sheet DDR1_D4
DDR1_D5: U1.A17(DDR1_DQ5) ; off-sheet DDR1_D5
DDR1_D6: U1.A18(DDR1_DQ6) ; off-sheet DDR1_D6
DDR1_D7: U1.B18(DDR1_DQ7) ; off-sheet DDR1_D7
DDR1_D8: U1.B11(DDR1_DQ8) ; off-sheet DDR1_D8
DDR1_D9: U1.B12(DDR1_DQ9) ; off-sheet DDR1_D9
DDR1_D10: U1.A11(DDR1_DQ10) ; off-sheet DDR1_D10
DDR1_D11: U1.B13(DDR1_DQ11) ; off-sheet DDR1_D11
DDR1_D12: U1.A12(DDR1_DQ12) ; off-sheet DDR1_D12
DDR1_D13: U1.A13(DDR1_DQ13) ; off-sheet DDR1_D13
DDR1_D14: U1.A14(DDR1_DQ14) ; off-sheet DDR1_D14
DDR1_D15: U1.B14(DDR1_DQ15) ; off-sheet DDR1_D15
DDR1_D16: U1.A19(DDR1_DQ16) ; off-sheet DDR1_D16
DDR1_D17: U1.B19(DDR1_DQ17) ; off-sheet DDR1_D17
DDR1_D18: U1.A20(DDR1_DQ18) ; off-sheet DDR1_D18
DDR1_D19: U1.B20(DDR1_DQ19) ; off-sheet DDR1_D19
DDR1_D20: U1.A21(DDR1_DQ20) ; off-sheet DDR1_D20
DDR1_D21: U1.B21(DDR1_DQ21) ; off-sheet DDR1_D21
DDR1_D22: U1.B22(DDR1_DQ22) ; off-sheet DDR1_D22
DDR1_D23: U1.A22(DDR1_DQ23) ; off-sheet DDR1_D23
DDR1_D24: U1.A23(DDR1_DQ24) ; off-sheet DDR1_D24
DDR1_D25: U1.B23(DDR1_DQ25) ; off-sheet DDR1_D25
DDR1_D26: U1.A24(DDR1_DQ26) ; off-sheet DDR1_D26
DDR1_D27: U1.A25(DDR1_DQ27) ; off-sheet DDR1_D27
DDR1_D28: U1.B24(DDR1_DQ28) ; off-sheet DDR1_D28
DDR1_D29: U1.A26(DDR1_DQ29) ; off-sheet DDR1_D29
DDR1_D30: U1.B25(DDR1_DQ30) ; off-sheet DDR1_D30
DDR1_D31: U1.B26(DDR1_DQ31) ; off-sheet DDR1_D31
DDR1_DM0: U1.E17(DDR1_DM0) ; off-sheet DDR1_DM0
DDR1_DM1: U1.E14(DDR1_DM1) ; off-sheet DDR1_DM1
DDR1_DM2: U1.E20(DDR1_DM2) ; off-sheet DDR1_DM2
DDR1_DM3: U1.E23(DDR1_DM3) ; off-sheet DDR1_DM3
DDR1_DQS0_N: U1.D17(DDR1_DQS0N) ; off-sheet DDR1_DQS0_N
DDR1_DQS0_P: U1.D18(DDR1_DQS0P) ; off-sheet DDR1_DQS0_P
DDR1_DQS1_N: U1.D14(DDR1_DQS1N) ; off-sheet DDR1_DQS1_N
DDR1_DQS1_P: U1.D15(DDR1_DQS1P) ; off-sheet DDR1_DQS1_P
DDR1_DQS2_N: U1.D20(DDR1_DQS2N) ; off-sheet DDR1_DQS2_N
DDR1_DQS2_P: U1.D21(DDR1_DQS2P) ; off-sheet DDR1_DQS2_P
DDR1_DQS3_N: U1.D23(DDR1_DQS3N) ; off-sheet DDR1_DQS3_N
DDR1_DQS3_P: U1.D24(DDR1_DQS3P) ; off-sheet DDR1_DQS3_P
DDR1_RST: U1.G11(DDR1_RESET) ; off-sheet DDR1_RST
NetFB2_1: FB2.1 U1.R8(DDR0PLL_AVDD_0V9)
NetFB3_1: FB3.1 U1.H14(DDR1PLL_AVDD_0V9)
NetFB4_1: FB4.1 U1.M7(DDR0_CLK_VDD)
NetFB5_1: FB5.1 U1.G12(DDR1_CLK_VDD)
NetR40_2: R40.2 U1.R7(DDR0_PZQ)
NetR41_2: R41.2 U1.G15(DDR1_PZQ)

Not connected (* = marked no-connect by the designer): U1 A3(DDR1_A12)* A4(DDR1_A10)* A6(DDR1_A9)* A7(DDR1_A7)* B2(DDR1_BA0)* B4(DDR1_A13)* B6(DDR1_A8)* B7(DDR1_A6)* C1(DDR0_A12)* C3(DDR0_BA0)* C4(DDR1_A14)* C5(DDR1_A11)* C6(DDR1_RASn)* D1(DDR0_A10)* D2(DDR0_A13)* D3(DDR0_A14)* D6(DDR1_BA1)* D11(DDR1_ODT0)* D12(DDR1_BA2)* E3(DDR0_A11)* E11(DDR1_ODT1)* F3(DDR0_RASn)* F4(DDR0_BA1)* F7(DDR1_WEn)* F9(DDR1_CASn)* F14(DDR1_PLL_TESTOUT_P)* F17(DDR1_ATB0)* G6(DDR0_WEn)* G8(DDR1_A15)* G14(DDR1_PLL_TESTOUT_N)* G17(DDR1_ATB1)* H6(DDR0_CASn)* H7(DDR0_A15)* J1(DDR0_A6)* J2(DDR0_A7)* K1(DDR0_A9)* K2(DDR0_A8)* L4(DDR0_ODT0)* L5(DDR0_ODT1)* M4(DDR0_BA2)* U6(DDR0_ATB0)* U7(DDR0_ATB1)* V6(DDR0_PLL_TESTOUT_P)* V7(DDR0_PLL_TESTOUT_N)*

### Layout directives
net class 50OHM_DDR_D: DDR0_D0, DDR0_D1, DDR0_D2, DDR0_D3, DDR0_D4, DDR0_D5, DDR0_D6, DDR0_D7, DDR0_D8, DDR0_D9, DDR0_D10, DDR0_D11, DDR0_D12, DDR0_D13, DDR0_D14, DDR0_D15, DDR0_D16, DDR0_D17, DDR0_D18, DDR0_D19, DDR0_D20, DDR0_D21, DDR0_D22, DDR0_D23, DDR0_D24, DDR0_D25, DDR0_D26, DDR0_D27, DDR0_D28, DDR0_D29, DDR0_D30, DDR0_D31, DDR0_DM0, DDR0_DM1, DDR0_DM2, DDR0_DM3, DDR1_D0, DDR1_D1, DDR1_D2, DDR1_D3, DDR1_D4, DDR1_D5, DDR1_D6, DDR1_D7, DDR1_D8, DDR1_D9, DDR1_D10, DDR1_D11, DDR1_D12, DDR1_D13, DDR1_D14, DDR1_D15, DDR1_D16, DDR1_D17, DDR1_D18, DDR1_D19, DDR1_D20, DDR1_D21, DDR1_D22, DDR1_D23, DDR1_D24, DDR1_D25, DDR1_D26, DDR1_D27, DDR1_D28, DDR1_D29, DDR1_D30, DDR1_D31, DDR1_DM0, DDR1_DM1, DDR1_DM2, DDR1_DM3
net class DDR_G-1: DDR0_D0, DDR0_D1, DDR0_D2, DDR0_D3, DDR0_D4, DDR0_D5, DDR0_D6, DDR0_D7, DDR0_DM0, DDR0_DQS0_N, DDR0_DQS0_P, DDR1_D0, DDR1_D1, DDR1_D2, DDR1_D3, DDR1_D4, DDR1_D5, DDR1_D6, DDR1_D7, DDR1_DM0, DDR1_DQS0_N, DDR1_DQS0_P
net class DDR_G-2: DDR0_D8, DDR0_D9, DDR0_D10, DDR0_D11, DDR0_D12, DDR0_D13, DDR0_D14, DDR0_D15, DDR0_DM1, DDR0_DQS1_N, DDR0_DQS1_P, DDR1_D8, DDR1_D9, DDR1_D10, DDR1_D11, DDR1_D12, DDR1_D13, DDR1_D14, DDR1_D15, DDR1_DM1, DDR1_DQS1_N, DDR1_DQS1_P
net class DDR_G-3: DDR0_D16, DDR0_D17, DDR0_D18, DDR0_D19, DDR0_D20, DDR0_D21, DDR0_D22, DDR0_D23, DDR0_DM2, DDR0_DQS2_N, DDR0_DQS2_P, DDR1_D16, DDR1_D17, DDR1_D18, DDR1_D19, DDR1_D20, DDR1_D21, DDR1_D22, DDR1_D23, DDR1_DM2, DDR1_DQS2_N, DDR1_DQS2_P
net class DDR_G-4: DDR0_D24, DDR0_D25, DDR0_D26, DDR0_D27, DDR0_D28, DDR0_D29, DDR0_D30, DDR0_D31, DDR0_DM3, DDR0_DQS3_N, DDR0_DQS3_P, DDR1_D24, DDR1_D25, DDR1_D26, DDR1_D27, DDR1_D28, DDR1_D29, DDR1_D30, DDR1_D31, DDR1_DM3, DDR1_DQS3_N, DDR1_DQS3_P
differential pair; differential pair class DIFF100_DDR_DQS: DDR0_DQS0_N, DDR0_DQS0_P, DDR0_DQS1_N, DDR0_DQS1_P, DDR0_DQS2_N, DDR0_DQS2_P, DDR0_DQS3_N, DDR0_DQS3_P, DDR1_DQS0_N, DDR1_DQS0_P, DDR1_DQS1_N, DDR1_DQS1_P, DDR1_DQS2_N, DDR1_DQS2_P, DDR1_DQS3_N, DDR1_DQS3_P
net class 50OHM_DDR_A: DDR0_A0, DDR0_A1, DDR0_A2, DDR0_A3, DDR0_A4, DDR0_A5, DDR1_A0, DDR1_A1, DDR1_A2, DDR1_A3, DDR1_A4, DDR1_A5
net class 50OHM_DDR_Ctrl: DDR0_CKE0, DDR0_CKE1, DDR0_CS0N, DDR0_CS1N, DDR0_CS2N, DDR0_CS3N, DDR1_CKE0, DDR1_CKE1, DDR1_CS0N, DDR1_CS1N, DDR1_CS2N, DDR1_CS3N
differential pair; differential pair class DIFF100_DDR_CLK: DDR0_CLK1_N, DDR0_CLK1_P, DDR0_CLK_N, DDR0_CLK_P, DDR1_CLK1_N, DDR1_CLK1_P, DDR1_CLK_N, DDR1_CLK_P
net class DIFF_PAIR_CLASS: DDR0_CLK1_N, DDR0_CLK1_P, DDR0_CLK_N, DDR0_CLK_P, DDR0_DQS0_N, DDR0_DQS0_P, DDR0_DQS1_N, DDR0_DQS1_P, DDR0_DQS2_N, DDR0_DQS2_P, DDR0_DQS3_N, DDR0_DQS3_P, DDR1_CLK1_N, DDR1_CLK1_P, DDR1_CLK_N, DDR1_CLK_P, DDR1_DQS0_N, DDR1_DQS0_P, DDR1_DQS1_N, DDR1_DQS1_P, DDR1_DQS2_N, DDR1_DQS2_P, DDR1_DQS3_N, DDR1_DQS3_P

### Notes on the sheet
- TITLE:
- DOCUMENT NAME:
- SCALE 1:1
- This document is copyright of Esteempcb and shall not be revealed, produced, copied, in whole or in part, nor
- PROJECT CODE:
- TEMPLATE:
- A3
- AUTHOR:
- Sheet
- of
- used for any purpose other than submitted.

### Library data of the parts
C100 C110 = CAP_22uF-6.3V-20%-0402: 22µF ±20% 6.3V Ceramic Capacitor X5R 0402 (1005 Metric) /; Manufacturer: Murata Electronics; Manufacturer Part Number: CL05A226MQ5N6J8; Case/Package: 0402; Supplier-1: Digikey
C101 C111 = CAP_10uF-10V-20%-0402: 10µF ±20% 10V Ceramic Capacitor X5R 0402 (1005 Metric) /; Manufacturer Part Number: CL05A106MP5NUNC; Manufacturer: Samsung Electro-Mechanics; Case/Package: 0402; Supplier-1: Digikey
C102 C112 = CAP_1uF-16V-10%-0201: 1µF ±20% 16V Ceramic Capacitor X5R 0201 (0603 Metric) /; Manufacturer: Samsung Electro-Mechanics; Manufacturer Part Number: CL03A105MO3NRNH; Case/Package: 0201; Supplier-1: Digikey
C103-C109 C113-C117 = CAP_100nF-25V-10%-0201: 0.1µF ±10% 25V Ceramic Capacitor X5R 0201 (0603 Metric) /; Manufacturer: TDK Corporation; Manufacturer Part Number: C0603X5R1E104K030BB; Case/Package: 0201; Supplier-1: Digikey
FB2-FB5 = FB_120R-1.3A-100Mhz-0402: 120 Ohms @ 100MHz 1 Power Line Ferrite Bead 0402 (1005 Metric) 1.3A 90mOhm; Manufacturer: Murata Electronics; Mnaufacturer Part Number: BLM15PD121SN1D; Case/Package: 0402; Supplier-1: Digikey
R40 R41 = RES_240R-0.05W-1%-0201: 240 Ohms ±1% 0.05W, 1/20W Chip Resistor 0201 (0603 Metric) Thick Film /; Manufacturer: Yageo; Manufacturer Part Number: RC0201FR-07240RL; Case/Package: 0201; Supplier-1: Digikey
U1 = IC_RK3399-FCBGA828: RK3399 is a low power, high performance processor for computing, personal mobile.; Manufacturer: Rockchip; Manufacturer Part Number: RK3399; Case/Package: FCBGA828; Supplier-1: Rockchip

## Sheet [9]-LPDDR4 SDRAM-1.SchDoc: RK3399 SOM Board Design V1.0
size A3; Author: ABC; Organization: Altium Limited; Address1: L3, 12a Rodborough Rd; Address2: Frenchs Forest; Address3: NSW; Address4: Australia 2086; DocumentNumber: 11; SheetNumber: 11; SheetTotal: 21; PROJECT CODE: A_V1.0
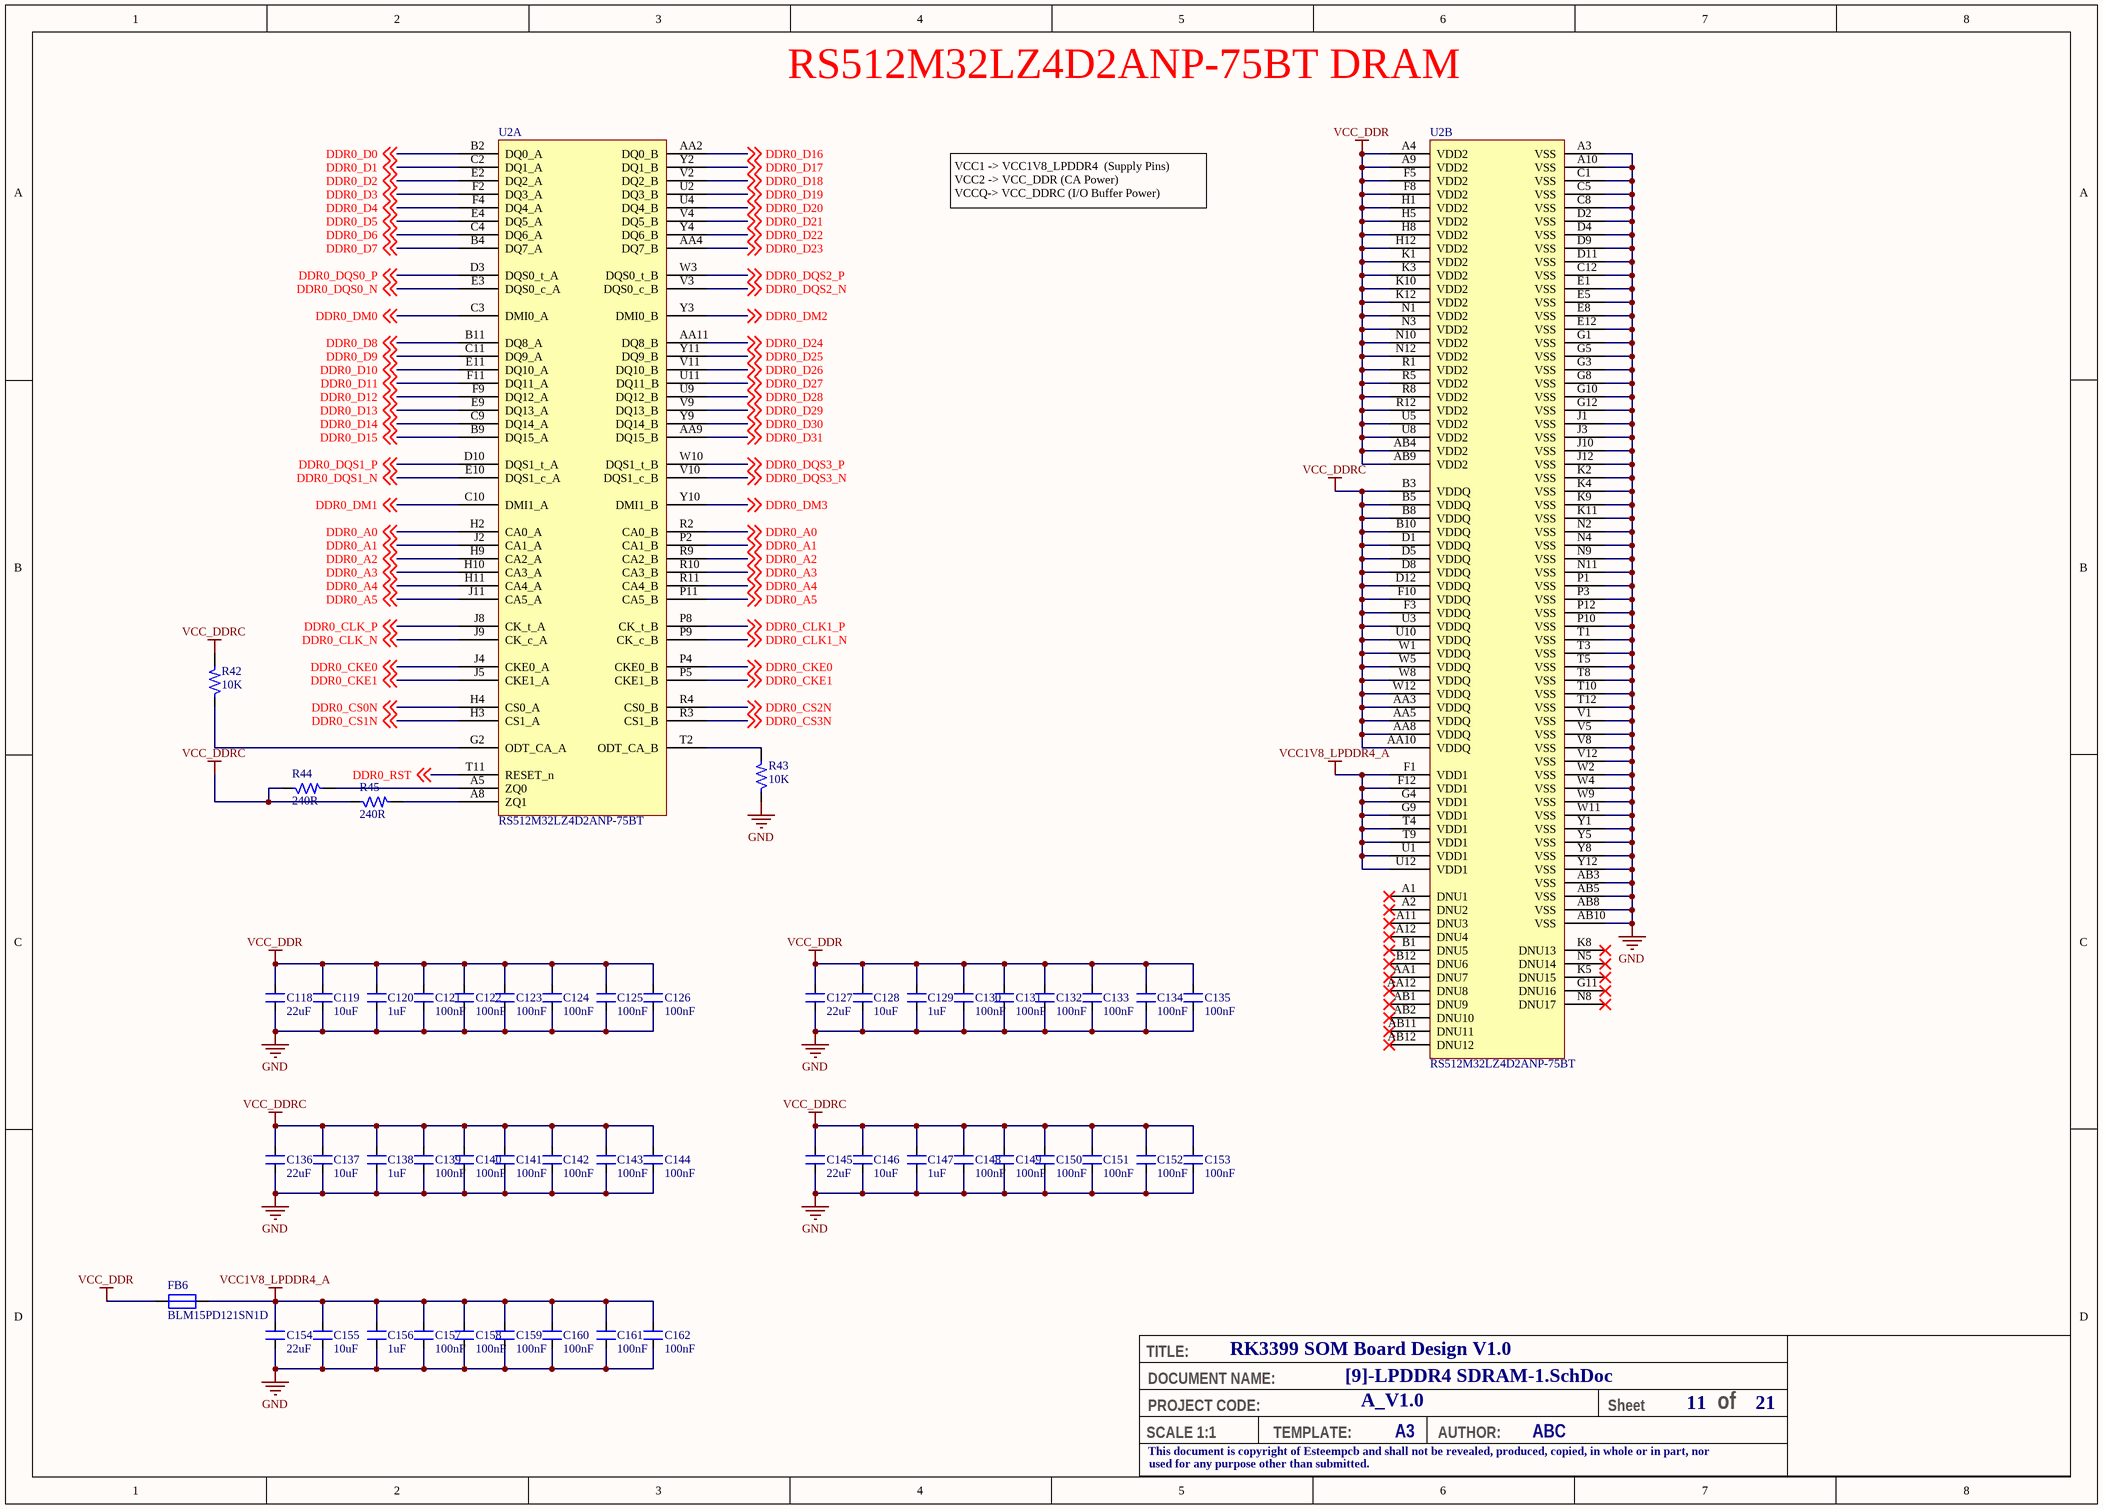
[diagram p10: [9]-LPDDR4 SDRAM-1.SchDoc]

### Parts
C118  22uF  [CAP_0402]
C119  10uF  [CAP_0402]
C120  1uF  [CAP_0201]
C121  100nF  [CAP_0201]
C122  100nF  [CAP_0201]
C123  100nF  [CAP_0201]
C124  100nF  [CAP_0201]
C125  100nF  [CAP_0201]
C126  100nF  [CAP_0201]
C127  22uF  [CAP_0402]
C128  10uF  [CAP_0402]
C129  1uF  [CAP_0201]
C130  100nF  [CAP_0201]
C131  100nF  [CAP_0201]
C132  100nF  [CAP_0201]
C133  100nF  [CAP_0201]
C134  100nF  [CAP_0201]
C135  100nF  [CAP_0201]
C136  22uF  [CAP_0402]
C137  10uF  [CAP_0402]
C138  1uF  [CAP_0201]
C139  100nF  [CAP_0201]
C140  100nF  [CAP_0201]
C141  100nF  [CAP_0201]
C142  100nF  [CAP_0201]
C143  100nF  [CAP_0201]
C144  100nF  [CAP_0201]
C145  22uF  [CAP_0402]
C146  10uF  [CAP_0402]
C147  1uF  [CAP_0201]
C148  100nF  [CAP_0201]
C149  100nF  [CAP_0201]
C150  100nF  [CAP_0201]
C151  100nF  [CAP_0201]
C152  100nF  [CAP_0201]
C153  100nF  [CAP_0201]
C154  22uF  [CAP_0402]
C155  10uF  [CAP_0402]
C156  1uF  [CAP_0201]
C157  100nF  [CAP_0201]
C158  100nF  [CAP_0201]
C159  100nF  [CAP_0201]
C160  100nF  [CAP_0201]
C161  100nF  [CAP_0201]
C162  100nF  [CAP_0201]
FB6  BLM15PD121SN1D  [RES_0402]
R42  10K  [RES_0201]
R43  10K  [RES_0201]
R44  240R  [RES_0201]
R45  240R  [RES_0201]
U2  RS512M32LZ4D2ANP-75BT  [FBGA200_SMD]  (parts A,B of 2)

### Nets
GND: C118.1 C119.1 C120.1 C121.1 C122.1 C123.1 C124.1 C125.1 C126.1 C127.1 C128.1 C129.1 C130.1 C131.1 C132.1 C133.1 C134.1 C135.1 C136.1 C137.1 C138.1 C139.1 C140.1 C141.1 C142.1 C143.1 C144.1 C145.1 C146.1 C147.1 C148.1 C149.1 C150.1 C151.1 C152.1 C153.1 C154.1 C155.1 C156.1 C157.1 C158.1 C159.1 C160.1 C161.1 C162.1 R43.1 U2.A3(VSS) U2.A10(VSS) U2.AB3(VSS) U2.AB5(VSS) U2.AB8(VSS) U2.AB10(VSS) U2.C1(VSS) U2.C5(VSS) U2.C8(VSS) U2.C12(VSS) U2.D2(VSS) U2.D4(VSS) U2.D9(VSS) U2.D11(VSS) U2.E1(VSS) U2.E5(VSS) U2.E8(VSS) U2.E12(VSS) U2.G1(VSS) U2.G3(VSS) U2.G5(VSS) U2.G8(VSS) U2.G10(VSS) U2.G12(VSS) U2.J1(VSS) U2.J3(VSS) U2.J10(VSS) U2.J12(VSS) U2.K2(VSS) U2.K4(VSS) U2.K9(VSS) U2.K11(VSS) U2.N2(VSS) U2.N4(VSS) U2.N9(VSS) U2.N11(VSS) U2.P1(VSS) U2.P3(VSS) U2.P10(VSS) U2.P12(VSS) U2.T1(VSS) U2.T3(VSS) U2.T5(VSS) U2.T8(VSS) U2.T10(VSS) U2.T12(VSS) U2.V1(VSS) U2.V5(VSS) U2.V8(VSS) U2.V12(VSS) U2.W2(VSS) U2.W4(VSS) U2.W9(VSS) U2.W11(VSS) U2.Y1(VSS) U2.Y5(VSS) U2.Y8(VSS) U2.Y12(VSS)
VCC1V8_LPDDR4_A: C154.2 C155.2 C156.2 C157.2 C158.2 C159.2 C160.2 C161.2 C162.2 FB6.2 U2.F1(VDD1) U2.F12(VDD1) U2.G4(VDD1) U2.G9(VDD1) U2.T4(VDD1) U2.T9(VDD1) U2.U1(VDD1) U2.U12(VDD1)
VCC_DDR: C118.2 C119.2 C120.2 C121.2 C122.2 C123.2 C124.2 C125.2 C126.2 C127.2 C128.2 C129.2 C130.2 C131.2 C132.2 C133.2 C134.2 C135.2 FB6.1 U2.A4(VDD2) U2.A9(VDD2) U2.AB4(VDD2) U2.AB9(VDD2) U2.F5(VDD2) U2.F8(VDD2) U2.H1(VDD2) U2.H5(VDD2) U2.H8(VDD2) U2.H12(VDD2) U2.K1(VDD2) U2.K3(VDD2) U2.K10(VDD2) U2.K12(VDD2) U2.N1(VDD2) U2.N3(VDD2) U2.N10(VDD2) U2.N12(VDD2) U2.R1(VDD2) U2.R5(VDD2) U2.R8(VDD2) U2.R12(VDD2) U2.U5(VDD2) U2.U8(VDD2)
VCC_DDRC: C136.2 C137.2 C138.2 C139.2 C140.2 C141.2 C142.2 C143.2 C144.2 C145.2 C146.2 C147.2 C148.2 C149.2 C150.2 C151.2 C152.2 C153.2 R42.2 R44.1 R45.1 U2.AA3(VDDQ) U2.AA5(VDDQ) U2.AA8(VDDQ) U2.AA10(VDDQ) U2.B3(VDDQ) U2.B5(VDDQ) U2.B8(VDDQ) U2.B10(VDDQ) U2.D1(VDDQ) U2.D5(VDDQ) U2.D8(VDDQ) U2.D12(VDDQ) U2.F3(VDDQ) U2.F10(VDDQ) U2.U3(VDDQ) U2.U10(VDDQ) U2.W1(VDDQ) U2.W5(VDDQ) U2.W8(VDDQ) U2.W12(VDDQ)
DDR0_A0: U2.H2(CA0_A) U2.R2(CA0_B) ; off-sheet DDR0_A0
DDR0_A1: U2.J2(CA1_A) U2.P2(CA1_B) ; off-sheet DDR0_A1
DDR0_A2: U2.H9(CA2_A) U2.R9(CA2_B) ; off-sheet DDR0_A2
DDR0_A3: U2.H10(CA3_A) U2.R10(CA3_B) ; off-sheet DDR0_A3
DDR0_A4: U2.H11(CA4_A) U2.R11(CA4_B) ; off-sheet DDR0_A4
DDR0_A5: U2.J11(CA5_A) U2.P11(CA5_B) ; off-sheet DDR0_A5
DDR0_CKE0: U2.J4(CKE0_A) U2.P4(CKE0_B) ; off-sheet DDR0_CKE0
DDR0_CKE1: U2.J5(CKE1_A) U2.P5(CKE1_B) ; off-sheet DDR0_CKE1
DDR0_CLK1_N: U2.P9(CK_c_B) ; off-sheet DDR0_CLK1_N
DDR0_CLK1_P: U2.P8(CK_t_B) ; off-sheet DDR0_CLK1_P
DDR0_CLK_N: U2.J9(CK_c_A) ; off-sheet DDR0_CLK_N
DDR0_CLK_P: U2.J8(CK_t_A) ; off-sheet DDR0_CLK_P
DDR0_CS0N: U2.H4(CS0_A) ; off-sheet DDR0_CS0N
DDR0_CS1N: U2.H3(CS1_A) ; off-sheet DDR0_CS1N
DDR0_CS2N: U2.R4(CS0_B) ; off-sheet DDR0_CS2N
DDR0_CS3N: U2.R3(CS1_B) ; off-sheet DDR0_CS3N
DDR0_D0: U2.B2(DQ0_A) ; off-sheet DDR0_D0
DDR0_D1: U2.C2(DQ1_A) ; off-sheet DDR0_D1
DDR0_D2: U2.E2(DQ2_A) ; off-sheet DDR0_D2
DDR0_D3: U2.F2(DQ3_A) ; off-sheet DDR0_D3
DDR0_D4: U2.F4(DQ4_A) ; off-sheet DDR0_D4
DDR0_D5: U2.E4(DQ5_A) ; off-sheet DDR0_D5
DDR0_D6: U2.C4(DQ6_A) ; off-sheet DDR0_D6
DDR0_D7: U2.B4(DQ7_A) ; off-sheet DDR0_D7
DDR0_D8: U2.B11(DQ8_A) ; off-sheet DDR0_D8
DDR0_D9: U2.C11(DQ9_A) ; off-sheet DDR0_D9
DDR0_D10: U2.E11(DQ10_A) ; off-sheet DDR0_D10
DDR0_D11: U2.F11(DQ11_A) ; off-sheet DDR0_D11
DDR0_D12: U2.F9(DQ12_A) ; off-sheet DDR0_D12
DDR0_D13: U2.E9(DQ13_A) ; off-sheet DDR0_D13
DDR0_D14: U2.C9(DQ14_A) ; off-sheet DDR0_D14
DDR0_D15: U2.B9(DQ15_A) ; off-sheet DDR0_D15
DDR0_D16: U2.AA2(DQ0_B) ; off-sheet DDR0_D16
DDR0_D17: U2.Y2(DQ1_B) ; off-sheet DDR0_D17
DDR0_D18: U2.V2(DQ2_B) ; off-sheet DDR0_D18
DDR0_D19: U2.U2(DQ3_B) ; off-sheet DDR0_D19
DDR0_D20: U2.U4(DQ4_B) ; off-sheet DDR0_D20
DDR0_D21: U2.V4(DQ5_B) ; off-sheet DDR0_D21
DDR0_D22: U2.Y4(DQ6_B) ; off-sheet DDR0_D22
DDR0_D23: U2.AA4(DQ7_B) ; off-sheet DDR0_D23
DDR0_D24: U2.AA11(DQ8_B) ; off-sheet DDR0_D24
DDR0_D25: U2.Y11(DQ9_B) ; off-sheet DDR0_D25
DDR0_D26: U2.V11(DQ10_B) ; off-sheet DDR0_D26
DDR0_D27: U2.U11(DQ11_B) ; off-sheet DDR0_D27
DDR0_D28: U2.U9(DQ12_B) ; off-sheet DDR0_D28
DDR0_D29: U2.V9(DQ13_B) ; off-sheet DDR0_D29
DDR0_D30: U2.Y9(DQ14_B) ; off-sheet DDR0_D30
DDR0_D31: U2.AA9(DQ15_B) ; off-sheet DDR0_D31
DDR0_DM0: U2.C3(DMI0_A) ; off-sheet DDR0_DM0
DDR0_DM1: U2.C10(DMI1_A) ; off-sheet DDR0_DM1
DDR0_DM2: U2.Y3(DMI0_B) ; off-sheet DDR0_DM2
DDR0_DM3: U2.Y10(DMI1_B) ; off-sheet DDR0_DM3
DDR0_DQS0_N: U2.E3(DQS0_c_A) ; off-sheet DDR0_DQS0_N
DDR0_DQS0_P: U2.D3(DQS0_t_A) ; off-sheet DDR0_DQS0_P
DDR0_DQS1_N: U2.E10(DQS1_c_A) ; off-sheet DDR0_DQS1_N
DDR0_DQS1_P: U2.D10(DQS1_t_A) ; off-sheet DDR0_DQS1_P
DDR0_DQS2_N: U2.V3(DQS0_c_B) ; off-sheet DDR0_DQS2_N
DDR0_DQS2_P: U2.W3(DQS0_t_B) ; off-sheet DDR0_DQS2_P
DDR0_DQS3_N: U2.V10(DQS1_c_B) ; off-sheet DDR0_DQS3_N
DDR0_DQS3_P: U2.W10(DQS1_t_B) ; off-sheet DDR0_DQS3_P
DDR0_RST: U2.T11(RESET_n) ; off-sheet DDR0_RST
NetR42_1: R42.1 U2.G2(ODT_CA_A)
NetR43_2: R43.2 U2.T2(ODT_CA_B)
NetR44_2: R44.2 U2.A5(ZQ0)
NetR45_2: R45.2 U2.A8(ZQ1)

Not connected (* = marked no-connect by the designer): U2 A1(DNU1)* A2(DNU2)* A11(DNU3)* A12(DNU4)* AA1(DNU7)* AA12(DNU8)* AB1(DNU9)* AB2(DNU10)* AB11(DNU11)* AB12(DNU12)* B1(DNU5)* B12(DNU6)* G11(DNU16)* K5(DNU15)* K8(DNU13)* N5(DNU14)* N8(DNU17)*

### Notes on the sheet
- RS512M32LZ4D2ANP-75BT DRAM
- VCC1 -> VCC1V8_LPDDR4  (Supply Pins)
  VCC2 -> VCC_DDR (CA Power)
  VCCQ-> VCC_DDRC (I/O Buffer Power)
- TITLE:
- DOCUMENT NAME:
- SCALE 1:1
- This document is copyright of Esteempcb and shall not be revealed, produced, copied, in whole or in part, nor
- PROJECT CODE:
- TEMPLATE:
- A3
- AUTHOR:
- Sheet
- of
- used for any purpose other than submitted.

### Library data of the parts
C118 C127 C136 C145 C154 = CAP_22uF-6.3V-20%-0402: as C100 on sheet [8]-RK3399 SDRAM Page; Case/Package: 0402; Supplier-1: Digikey
C119 C128 C137 C146 C155 = CAP_10uF-10V-20%-0402: as C101 on sheet [8]-RK3399 SDRAM Page; Case/Package: 0402; Supplier-1: Digikey
C120 C129 C138 C147 C156 = CAP_1uF-16V-10%-0201: as C102 on sheet [8]-RK3399 SDRAM Page; Case/Package: 0201; Supplier-1: Digikey
C121-C126 C130-C135 C139-C144 C148-C153 C157-C162 = CAP_100nF-25V-10%-0201: as C103-C109 on sheet [8]-RK3399 SDRAM Page; Case/Package: 0201; Supplier-1: Digikey
FB6 = FB_120R-1.3A-100Mhz-0402: as FB2-FB5 on sheet [8]-RK3399 SDRAM Page; Mnaufacturer Part Number: BLM15PD121SN1D; Case/Package: 0402; Supplier-1: Digikey
R42 R43 = RES_10K-0.05W-1%-0201: 10 kOhms ±1% 0.05W, 1/20W Chip Resistor 0201 (0603 Metric) Thick Film /; Manufacturer: Stackpole Electronics Inc; Manufacturer Part Number: RMCF0201FT10K0; Case/Package: 0201; Supplier-1: Digikey
R44 R45 = RES_240R-0.05W-1%-0201: as R40 on sheet [8]-RK3399 SDRAM Page; Case/Package: 0201; Supplier-1: Digikey
U2 = IC_RS512M32LZ4D2ANP-75BT: LPDDR4/4X Package FBGA 200b Density 4Gbit~64Gbit Operating Temperature Range：-25~85℃ Speed：2667Mbps/3200Mbps/3733Mbps Voltage：VDD1/VDD2/VDDQ= 1.8 / 1.1 / 1.1 V（LPDDR4）VDD1/VDD2/VDDQ = 1.8 / 1.1 / 0.6 V（LPDDR4X）Approved Verification Platform：MTK、Spreadtrum; Manufacturer: RAYSON; Manufacturer Part Number: RS512M32LZ4D2ANP-75BT; Case/Package: FBGA 200b; Supplier-1: RAYSON

## Sheet [10]-LPDDR4 SDRAM-2.SchDoc: RK3399 SOM Board Design V1.0
size A3; Author: ABC; Organization: Altium Limited; Address1: L3, 12a Rodborough Rd; Address2: Frenchs Forest; Address3: NSW; Address4: Australia 2086; DocumentNumber: 12; SheetNumber: 12; SheetTotal: 21; PROJECT CODE: A_V1.0
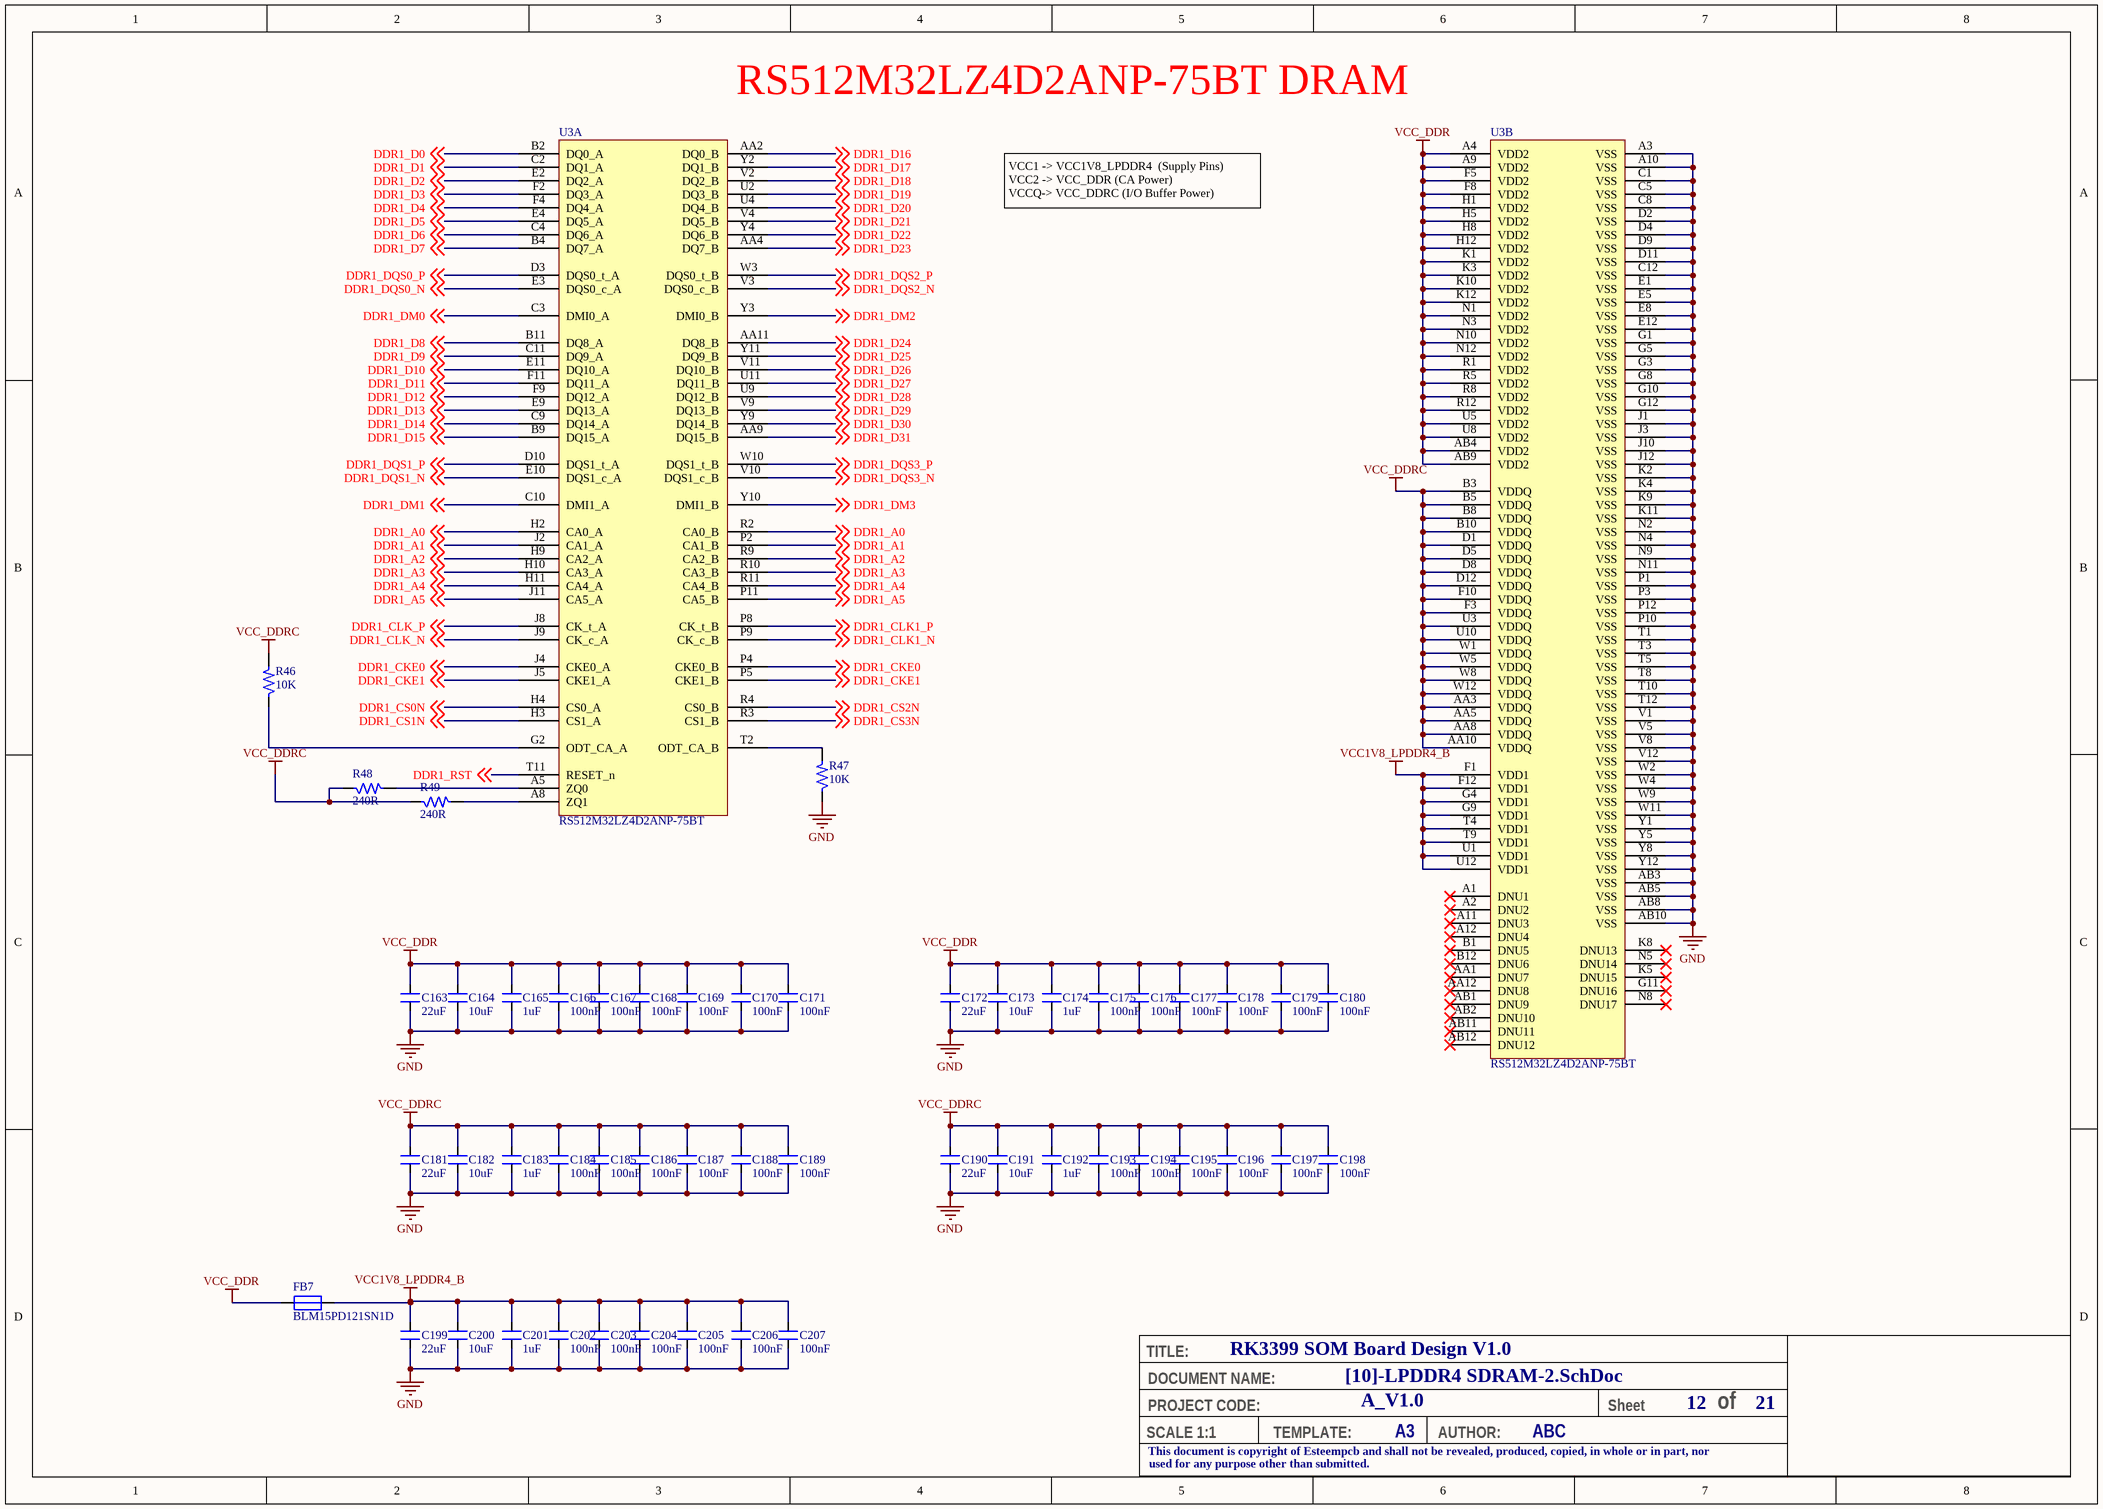
[diagram p11: [10]-LPDDR4 SDRAM-2.SchDoc]

### Parts
C163  22uF  [CAP_0402]
C164  10uF  [CAP_0402]
C165  1uF  [CAP_0201]
C166  100nF  [CAP_0201]
C167  100nF  [CAP_0201]
C168  100nF  [CAP_0201]
C169  100nF  [CAP_0201]
C170  100nF  [CAP_0201]
C171  100nF  [CAP_0201]
C172  22uF  [CAP_0402]
C173  10uF  [CAP_0402]
C174  1uF  [CAP_0201]
C175  100nF  [CAP_0201]
C176  100nF  [CAP_0201]
C177  100nF  [CAP_0201]
C178  100nF  [CAP_0201]
C179  100nF  [CAP_0201]
C180  100nF  [CAP_0201]
C181  22uF  [CAP_0402]
C182  10uF  [CAP_0402]
C183  1uF  [CAP_0201]
C184  100nF  [CAP_0201]
C185  100nF  [CAP_0201]
C186  100nF  [CAP_0201]
C187  100nF  [CAP_0201]
C188  100nF  [CAP_0201]
C189  100nF  [CAP_0201]
C190  22uF  [CAP_0402]
C191  10uF  [CAP_0402]
C192  1uF  [CAP_0201]
C193  100nF  [CAP_0201]
C194  100nF  [CAP_0201]
C195  100nF  [CAP_0201]
C196  100nF  [CAP_0201]
C197  100nF  [CAP_0201]
C198  100nF  [CAP_0201]
C199  22uF  [CAP_0402]
C200  10uF  [CAP_0402]
C201  1uF  [CAP_0201]
C202  100nF  [CAP_0201]
C203  100nF  [CAP_0201]
C204  100nF  [CAP_0201]
C205  100nF  [CAP_0201]
C206  100nF  [CAP_0201]
C207  100nF  [CAP_0201]
FB7  BLM15PD121SN1D  [RES_0402]
R46  10K  [RES_0201]
R47  10K  [RES_0201]
R48  240R  [RES_0201]
R49  240R  [RES_0201]
U3  RS512M32LZ4D2ANP-75BT  [FBGA200_SMD]  (parts A,B of 2)

### Nets
GND: C163.1 C164.1 C165.1 C166.1 C167.1 C168.1 C169.1 C170.1 C171.1 C172.1 C173.1 C174.1 C175.1 C176.1 C177.1 C178.1 C179.1 C180.1 C181.1 C182.1 C183.1 C184.1 C185.1 C186.1 C187.1 C188.1 C189.1 C190.1 C191.1 C192.1 C193.1 C194.1 C195.1 C196.1 C197.1 C198.1 C199.1 C200.1 C201.1 C202.1 C203.1 C204.1 C205.1 C206.1 C207.1 R47.1 U3.A3(VSS) U3.A10(VSS) U3.AB3(VSS) U3.AB5(VSS) U3.AB8(VSS) U3.AB10(VSS) U3.C1(VSS) U3.C5(VSS) U3.C8(VSS) U3.C12(VSS) U3.D2(VSS) U3.D4(VSS) U3.D9(VSS) U3.D11(VSS) U3.E1(VSS) U3.E5(VSS) U3.E8(VSS) U3.E12(VSS) U3.G1(VSS) U3.G3(VSS) U3.G5(VSS) U3.G8(VSS) U3.G10(VSS) U3.G12(VSS) U3.J1(VSS) U3.J3(VSS) U3.J10(VSS) U3.J12(VSS) U3.K2(VSS) U3.K4(VSS) U3.K9(VSS) U3.K11(VSS) U3.N2(VSS) U3.N4(VSS) U3.N9(VSS) U3.N11(VSS) U3.P1(VSS) U3.P3(VSS) U3.P10(VSS) U3.P12(VSS) U3.T1(VSS) U3.T3(VSS) U3.T5(VSS) U3.T8(VSS) U3.T10(VSS) U3.T12(VSS) U3.V1(VSS) U3.V5(VSS) U3.V8(VSS) U3.V12(VSS) U3.W2(VSS) U3.W4(VSS) U3.W9(VSS) U3.W11(VSS) U3.Y1(VSS) U3.Y5(VSS) U3.Y8(VSS) U3.Y12(VSS)
VCC1V8_LPDDR4_B: C199.2 C200.2 C201.2 C202.2 C203.2 C204.2 C205.2 C206.2 C207.2 FB7.2 U3.F1(VDD1) U3.F12(VDD1) U3.G4(VDD1) U3.G9(VDD1) U3.T4(VDD1) U3.T9(VDD1) U3.U1(VDD1) U3.U12(VDD1)
VCC_DDR: C163.2 C164.2 C165.2 C166.2 C167.2 C168.2 C169.2 C170.2 C171.2 C172.2 C173.2 C174.2 C175.2 C176.2 C177.2 C178.2 C179.2 C180.2 FB7.1 U3.A4(VDD2) U3.A9(VDD2) U3.AB4(VDD2) U3.AB9(VDD2) U3.F5(VDD2) U3.F8(VDD2) U3.H1(VDD2) U3.H5(VDD2) U3.H8(VDD2) U3.H12(VDD2) U3.K1(VDD2) U3.K3(VDD2) U3.K10(VDD2) U3.K12(VDD2) U3.N1(VDD2) U3.N3(VDD2) U3.N10(VDD2) U3.N12(VDD2) U3.R1(VDD2) U3.R5(VDD2) U3.R8(VDD2) U3.R12(VDD2) U3.U5(VDD2) U3.U8(VDD2)
VCC_DDRC: C181.2 C182.2 C183.2 C184.2 C185.2 C186.2 C187.2 C188.2 C189.2 C190.2 C191.2 C192.2 C193.2 C194.2 C195.2 C196.2 C197.2 C198.2 R46.2 R48.1 R49.1 U3.AA3(VDDQ) U3.AA5(VDDQ) U3.AA8(VDDQ) U3.AA10(VDDQ) U3.B3(VDDQ) U3.B5(VDDQ) U3.B8(VDDQ) U3.B10(VDDQ) U3.D1(VDDQ) U3.D5(VDDQ) U3.D8(VDDQ) U3.D12(VDDQ) U3.F3(VDDQ) U3.F10(VDDQ) U3.U3(VDDQ) U3.U10(VDDQ) U3.W1(VDDQ) U3.W5(VDDQ) U3.W8(VDDQ) U3.W12(VDDQ)
DDR1_A0: U3.H2(CA0_A) U3.R2(CA0_B) ; off-sheet DDR1_A0
DDR1_A1: U3.J2(CA1_A) U3.P2(CA1_B) ; off-sheet DDR1_A1
DDR1_A2: U3.H9(CA2_A) U3.R9(CA2_B) ; off-sheet DDR1_A2
DDR1_A3: U3.H10(CA3_A) U3.R10(CA3_B) ; off-sheet DDR1_A3
DDR1_A4: U3.H11(CA4_A) U3.R11(CA4_B) ; off-sheet DDR1_A4
DDR1_A5: U3.J11(CA5_A) U3.P11(CA5_B) ; off-sheet DDR1_A5
DDR1_CKE0: U3.J4(CKE0_A) U3.P4(CKE0_B) ; off-sheet DDR1_CKE0
DDR1_CKE1: U3.J5(CKE1_A) U3.P5(CKE1_B) ; off-sheet DDR1_CKE1
DDR1_CLK1_N: U3.P9(CK_c_B) ; off-sheet DDR1_CLK1_N
DDR1_CLK1_P: U3.P8(CK_t_B) ; off-sheet DDR1_CLK1_P
DDR1_CLK_N: U3.J9(CK_c_A) ; off-sheet DDR1_CLK_N
DDR1_CLK_P: U3.J8(CK_t_A) ; off-sheet DDR1_CLK_P
DDR1_CS0N: U3.H4(CS0_A) ; off-sheet DDR1_CS0N
DDR1_CS1N: U3.H3(CS1_A) ; off-sheet DDR1_CS1N
DDR1_CS2N: U3.R4(CS0_B) ; off-sheet DDR1_CS2N
DDR1_CS3N: U3.R3(CS1_B) ; off-sheet DDR1_CS3N
DDR1_D0: U3.B2(DQ0_A) ; off-sheet DDR1_D0
DDR1_D1: U3.C2(DQ1_A) ; off-sheet DDR1_D1
DDR1_D2: U3.E2(DQ2_A) ; off-sheet DDR1_D2
DDR1_D3: U3.F2(DQ3_A) ; off-sheet DDR1_D3
DDR1_D4: U3.F4(DQ4_A) ; off-sheet DDR1_D4
DDR1_D5: U3.E4(DQ5_A) ; off-sheet DDR1_D5
DDR1_D6: U3.C4(DQ6_A) ; off-sheet DDR1_D6
DDR1_D7: U3.B4(DQ7_A) ; off-sheet DDR1_D7
DDR1_D8: U3.B11(DQ8_A) ; off-sheet DDR1_D8
DDR1_D9: U3.C11(DQ9_A) ; off-sheet DDR1_D9
DDR1_D10: U3.E11(DQ10_A) ; off-sheet DDR1_D10
DDR1_D11: U3.F11(DQ11_A) ; off-sheet DDR1_D11
DDR1_D12: U3.F9(DQ12_A) ; off-sheet DDR1_D12
DDR1_D13: U3.E9(DQ13_A) ; off-sheet DDR1_D13
DDR1_D14: U3.C9(DQ14_A) ; off-sheet DDR1_D14
DDR1_D15: U3.B9(DQ15_A) ; off-sheet DDR1_D15
DDR1_D16: U3.AA2(DQ0_B) ; off-sheet DDR1_D16
DDR1_D17: U3.Y2(DQ1_B) ; off-sheet DDR1_D17
DDR1_D18: U3.V2(DQ2_B) ; off-sheet DDR1_D18
DDR1_D19: U3.U2(DQ3_B) ; off-sheet DDR1_D19
DDR1_D20: U3.U4(DQ4_B) ; off-sheet DDR1_D20
DDR1_D21: U3.V4(DQ5_B) ; off-sheet DDR1_D21
DDR1_D22: U3.Y4(DQ6_B) ; off-sheet DDR1_D22
DDR1_D23: U3.AA4(DQ7_B) ; off-sheet DDR1_D23
DDR1_D24: U3.AA11(DQ8_B) ; off-sheet DDR1_D24
DDR1_D25: U3.Y11(DQ9_B) ; off-sheet DDR1_D25
DDR1_D26: U3.V11(DQ10_B) ; off-sheet DDR1_D26
DDR1_D27: U3.U11(DQ11_B) ; off-sheet DDR1_D27
DDR1_D28: U3.U9(DQ12_B) ; off-sheet DDR1_D28
DDR1_D29: U3.V9(DQ13_B) ; off-sheet DDR1_D29
DDR1_D30: U3.Y9(DQ14_B) ; off-sheet DDR1_D30
DDR1_D31: U3.AA9(DQ15_B) ; off-sheet DDR1_D31
DDR1_DM0: U3.C3(DMI0_A) ; off-sheet DDR1_DM0
DDR1_DM1: U3.C10(DMI1_A) ; off-sheet DDR1_DM1
DDR1_DM2: U3.Y3(DMI0_B) ; off-sheet DDR1_DM2
DDR1_DM3: U3.Y10(DMI1_B) ; off-sheet DDR1_DM3
DDR1_DQS0_N: U3.E3(DQS0_c_A) ; off-sheet DDR1_DQS0_N
DDR1_DQS0_P: U3.D3(DQS0_t_A) ; off-sheet DDR1_DQS0_P
DDR1_DQS1_N: U3.E10(DQS1_c_A) ; off-sheet DDR1_DQS1_N
DDR1_DQS1_P: U3.D10(DQS1_t_A) ; off-sheet DDR1_DQS1_P
DDR1_DQS2_N: U3.V3(DQS0_c_B) ; off-sheet DDR1_DQS2_N
DDR1_DQS2_P: U3.W3(DQS0_t_B) ; off-sheet DDR1_DQS2_P
DDR1_DQS3_N: U3.V10(DQS1_c_B) ; off-sheet DDR1_DQS3_N
DDR1_DQS3_P: U3.W10(DQS1_t_B) ; off-sheet DDR1_DQS3_P
DDR1_RST: U3.T11(RESET_n) ; off-sheet DDR1_RST
NetR46_1: R46.1 U3.G2(ODT_CA_A)
NetR47_2: R47.2 U3.T2(ODT_CA_B)
NetR48_2: R48.2 U3.A5(ZQ0)
NetR49_2: R49.2 U3.A8(ZQ1)

Not connected (* = marked no-connect by the designer): U3 A1(DNU1)* A2(DNU2)* A11(DNU3)* A12(DNU4)* AA1(DNU7)* AA12(DNU8)* AB1(DNU9)* AB2(DNU10)* AB11(DNU11)* AB12(DNU12)* B1(DNU5)* B12(DNU6)* G11(DNU16)* K5(DNU15)* K8(DNU13)* N5(DNU14)* N8(DNU17)*

### Notes on the sheet
- (near U3) RS512M32LZ4D2ANP-75BT DRAM
- VCC1 -> VCC1V8_LPDDR4  (Supply Pins)
  VCC2 -> VCC_DDR (CA Power)
  VCCQ-> VCC_DDRC (I/O Buffer Power)
- TITLE:
- DOCUMENT NAME:
- SCALE 1:1
- This document is copyright of Esteempcb and shall not be revealed, produced, copied, in whole or in part, nor
- PROJECT CODE:
- TEMPLATE:
- A3
- AUTHOR:
- Sheet
- of
- used for any purpose other than submitted.

### Library data of the parts
C163 C172 C181 C190 C199 = CAP_22uF-6.3V-20%-0402: as C100 on sheet [8]-RK3399 SDRAM Page; Case/Package: 0402; Supplier-1: Digikey
C164 C173 C182 C191 C200 = CAP_10uF-10V-20%-0402: as C101 on sheet [8]-RK3399 SDRAM Page; Case/Package: 0402; Supplier-1: Digikey
C165 C174 C183 C192 C201 = CAP_1uF-16V-10%-0201: as C102 on sheet [8]-RK3399 SDRAM Page; Case/Package: 0201; Supplier-1: Digikey
C166-C171 C175-C180 C184-C189 C193-C198 C202-C207 = CAP_100nF-25V-10%-0201: as C103-C109 on sheet [8]-RK3399 SDRAM Page; Case/Package: 0201; Supplier-1: Digikey
FB7 = FB_120R-1.3A-100Mhz-0402: as FB2-FB5 on sheet [8]-RK3399 SDRAM Page; Mnaufacturer Part Number: BLM15PD121SN1D; Case/Package: 0402; Supplier-1: Digikey
R46 R47 = RES_10K-0.05W-1%-0201: as R42 on sheet [9]-LPDDR4 SDRAM-1; Case/Package: 0201; Supplier-1: Digikey
R48 R49 = RES_240R-0.05W-1%-0201: as R40 on sheet [8]-RK3399 SDRAM Page; Case/Package: 0201; Supplier-1: Digikey
U3 = IC_RS512M32LZ4D2ANP-75BT: as U2 on sheet [9]-LPDDR4 SDRAM-1; Manufacturer Part Number: RS512M32LZ4D2ANP-75BT; Case/Package: FBGA 200b; Supplier-1: RAYSON

## Sheet [11]-EMMC Chip.SchDoc: RK3399 SOM Board Design V1.0
size A4; Author: AVIRAL MISHRA; DocumentNumber: 13; SheetNumber: 13; SheetTotal: 21; PROJECT CODE: A_V1.0
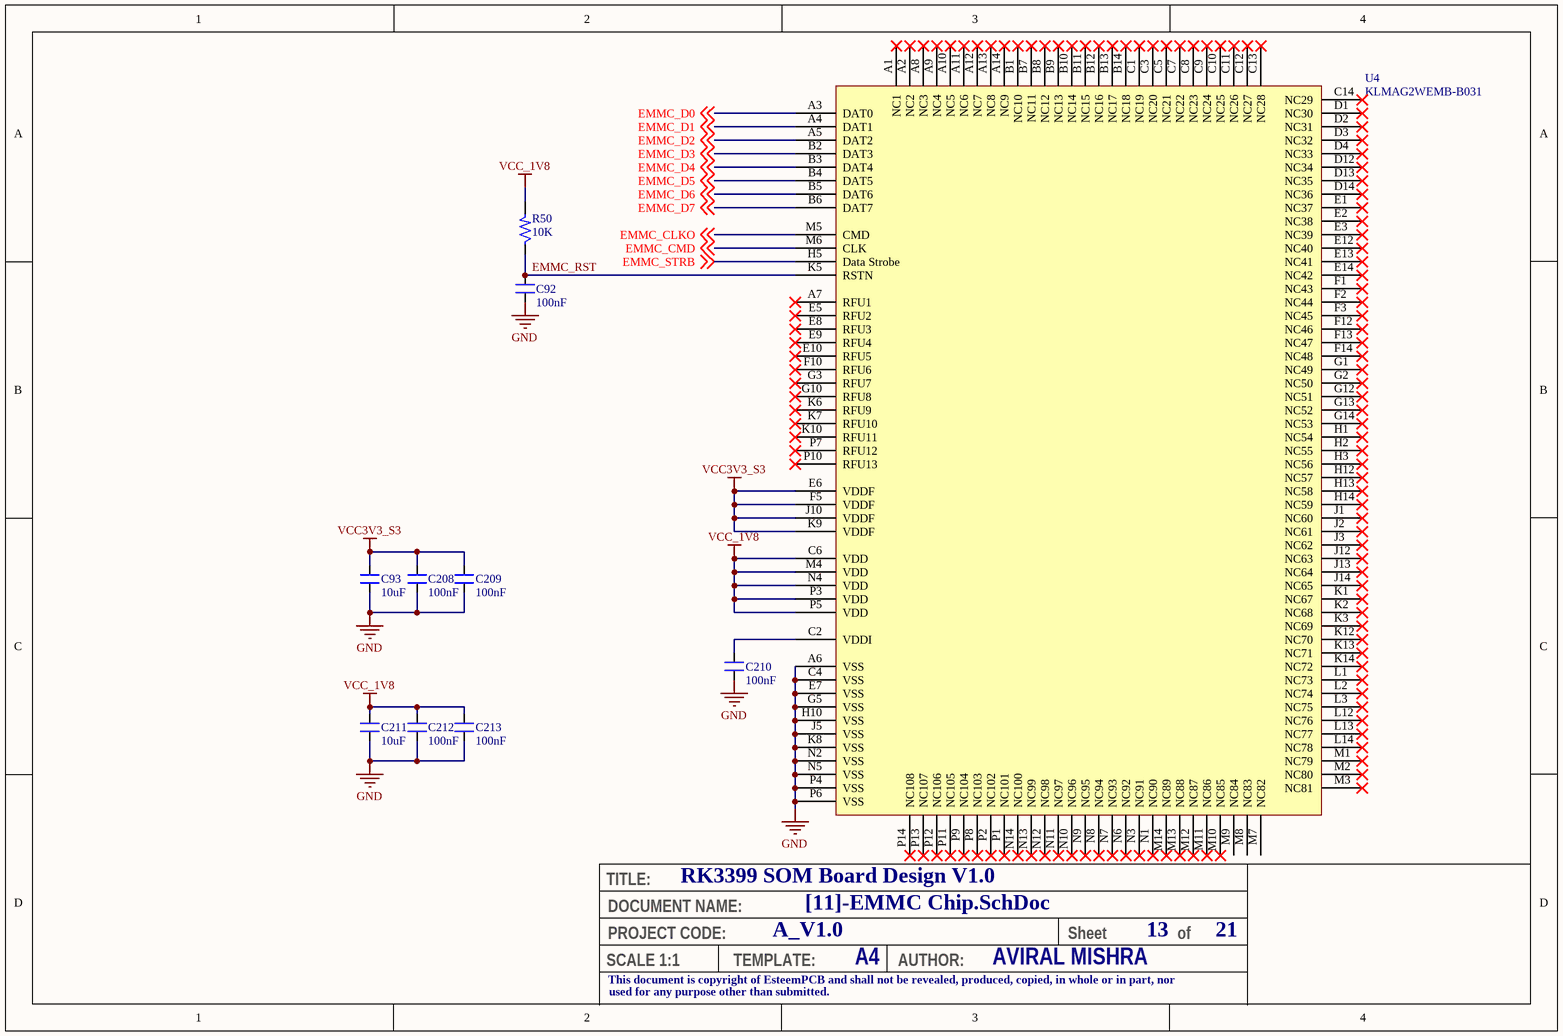
[diagram p12: [11]-EMMC Chip.SchDoc]

### Parts
(Parts that share a designator on the sheet are numbered #1, #2 ... from top to bottom, then left to right.)
C92#2  100nF  [CAP_0201]
C93#2  10uF  [CAP_0402]
C208  100nF  [CAP_0201]
C209  100nF  [CAP_0201]
C210  100nF  [CAP_0201]
C211  10uF  [CAP_0402]
C212  100nF  [CAP_0201]
C213  100nF  [CAP_0201]
R50  10K  [RES_0201]
U4  KLMAG2WEMB-B031  [BGA153C50P14X14_1150X1300X70]

### Nets
GND: C92#2.1 C93#2.1 C208.1 C209.1 C210.1 C211.1 C212.1 C213.1 U4.A6(VSS) U4.C4(VSS) U4.E7(VSS) U4.G5(VSS) U4.H10(VSS) U4.J5(VSS) U4.K8(VSS) U4.N2(VSS) U4.N5(VSS) U4.P4(VSS) U4.P6(VSS)
VCC3V3_S3: C93#2.2 C208.2 C209.2 U4.E6(VDDF) U4.F5(VDDF) U4.J10(VDDF) U4.K9(VDDF)
VCC_1V8: C211.2 C212.2 C213.2 R50.2 U4.C6(VDD) U4.M4(VDD) U4.N4(VDD) U4.P3(VDD) U4.P5(VDD)
EMMC_CLKO: U4.M5(CMD) ; off-sheet EMMC_CLKO
EMMC_CMD: U4.M6(CLK) ; off-sheet EMMC_CMD
EMMC_D0: U4.A3(DAT0) ; off-sheet EMMC_D0
EMMC_D1: U4.A4(DAT1) ; off-sheet EMMC_D1
EMMC_D2: U4.A5(DAT2) ; off-sheet EMMC_D2
EMMC_D3: U4.B2(DAT3) ; off-sheet EMMC_D3
EMMC_D4: U4.B3(DAT4) ; off-sheet EMMC_D4
EMMC_D5: U4.B4(DAT5) ; off-sheet EMMC_D5
EMMC_D6: U4.B5(DAT6) ; off-sheet EMMC_D6
EMMC_D7: U4.B6(DAT7) ; off-sheet EMMC_D7
EMMC_RST: C92#2.2 R50.1 U4.K5(RSTN)
EMMC_STRB: U4.H5(Data_Strobe) ; off-sheet EMMC_STRB
NetC210_2: C210.2 U4.C2(VDDI)

Not connected (* = marked no-connect by the designer): U4 A1(NC1)* A2(NC2)* A7(RFU1)* A8(NC3)* A9(NC4)* A10(NC5)* A11(NC6)* A12(NC7)* A13(NC8)* A14(NC9)* B1(NC10)* B7(NC11)* B8(NC12)* B9(NC13)* B10(NC14)* B11(NC15)* B12(NC16)* B13(NC17)* B14(NC18)* C1(NC19)* C3(NC20)* C5(NC21)* C7(NC22)* C8(NC23)* C9(NC24)* C10(NC25)* C11(NC26)* C12(NC27)* C13(NC28)* C14(NC29)* D1(NC30)* D2(NC31)* D3(NC32)* D4(NC33)* D12(NC34)* D13(NC35)* D14(NC36)* E1(NC37)* E2(NC38)* E3(NC39)* E5(RFU2)* E8(RFU3)* E9(RFU4)* E10(RFU5)* E12(NC40)* E13(NC41)* E14(NC42)* F1(NC43)* F2(NC44)* F3(NC45)* F10(RFU6)* F12(NC46)* F13(NC47)* F14(NC48)* G1(NC49)* G2(NC50)* G3(RFU7)* G10(RFU8)* G12(NC51)* G13(NC52)* G14(NC53)* H1(NC54)* H2(NC55)* H3(NC56)* H12(NC57)* H13(NC58)* H14(NC59)* J1(NC60)* J2(NC61)* J3(NC62)* J12(NC63)* J13(NC64)* J14(NC65)* K1(NC67)* K2(NC68)* K3(NC69)* K6(RFU9)* K7(RFU10)* K10(RFU11)* K12(NC70)* K13(NC71)* K14(NC72)* L1(NC73)* L2(NC74)* L3(NC75)* L12(NC76)* L13(NC77)* L14(NC78)* M1(NC79)* M2(NC80)* M3(NC81)* M7(NC82) M8(NC83) M9(NC84) M10(NC85)* M11(NC86)* M12(NC87)* M13(NC88)* M14(NC89)* N1(NC90)* N3(NC91)* N6(NC92)* N7(NC93)* N8(NC94)* N9(NC95)* N10(NC96)* N11(NC97)* N12(NC98)* N13(NC99)* N14(NC100)* P1(NC101)* P2(NC102)* P7(RFU12)* P8(NC103)* P9(NC104)* P10(RFU13)* P11(NC105)* P12(NC106)* P13(NC107)* P14(NC108)*

### Notes on the sheet
- TITLE:
- DOCUMENT NAME:
- SCALE 1:1
- This document is copyright of EsteemPCB and shall not be revealed, produced, copied, in whole or in part, nor
- PROJECT CODE:
- TEMPLATE:
- A4
- AUTHOR:
- Sheet
- of
- used for any purpose other than submitted.

### Library data of the parts
C92#2 C208-C210 C212 C213 = CAP_100nF-25V-10%-0201: as C103-C109 on sheet [8]-RK3399 SDRAM Page; Case/Package: 0201; Supplier-1: Digikey
C93#2 C211 = CAP_10uF-10V-20%-0402: as C101 on sheet [8]-RK3399 SDRAM Page; Case/Package: 0402; Supplier-1: Digikey
R50 = RES_10K-0.05W-1%-0201: as R42 on sheet [9]-LPDDR4 SDRAM-1; Case/Package: 0201; Supplier-1: Digikey
U4 = IC_KLMAG2WEMB-B031: 16GB NAND Flash Memory; Manufacturer: Samsung Electronics; Manufacturer Part Number: KLMAG2WEMB-B031; Case/Package: 153-FBGA; Supplier-1: NA